# EAGLE schematic system (EAGLE 9.6.1)

## Sheet 1 of 2: 总架构图
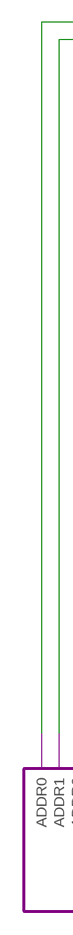
[diagram p0: schematic, sheet 1, part 1 of 2]
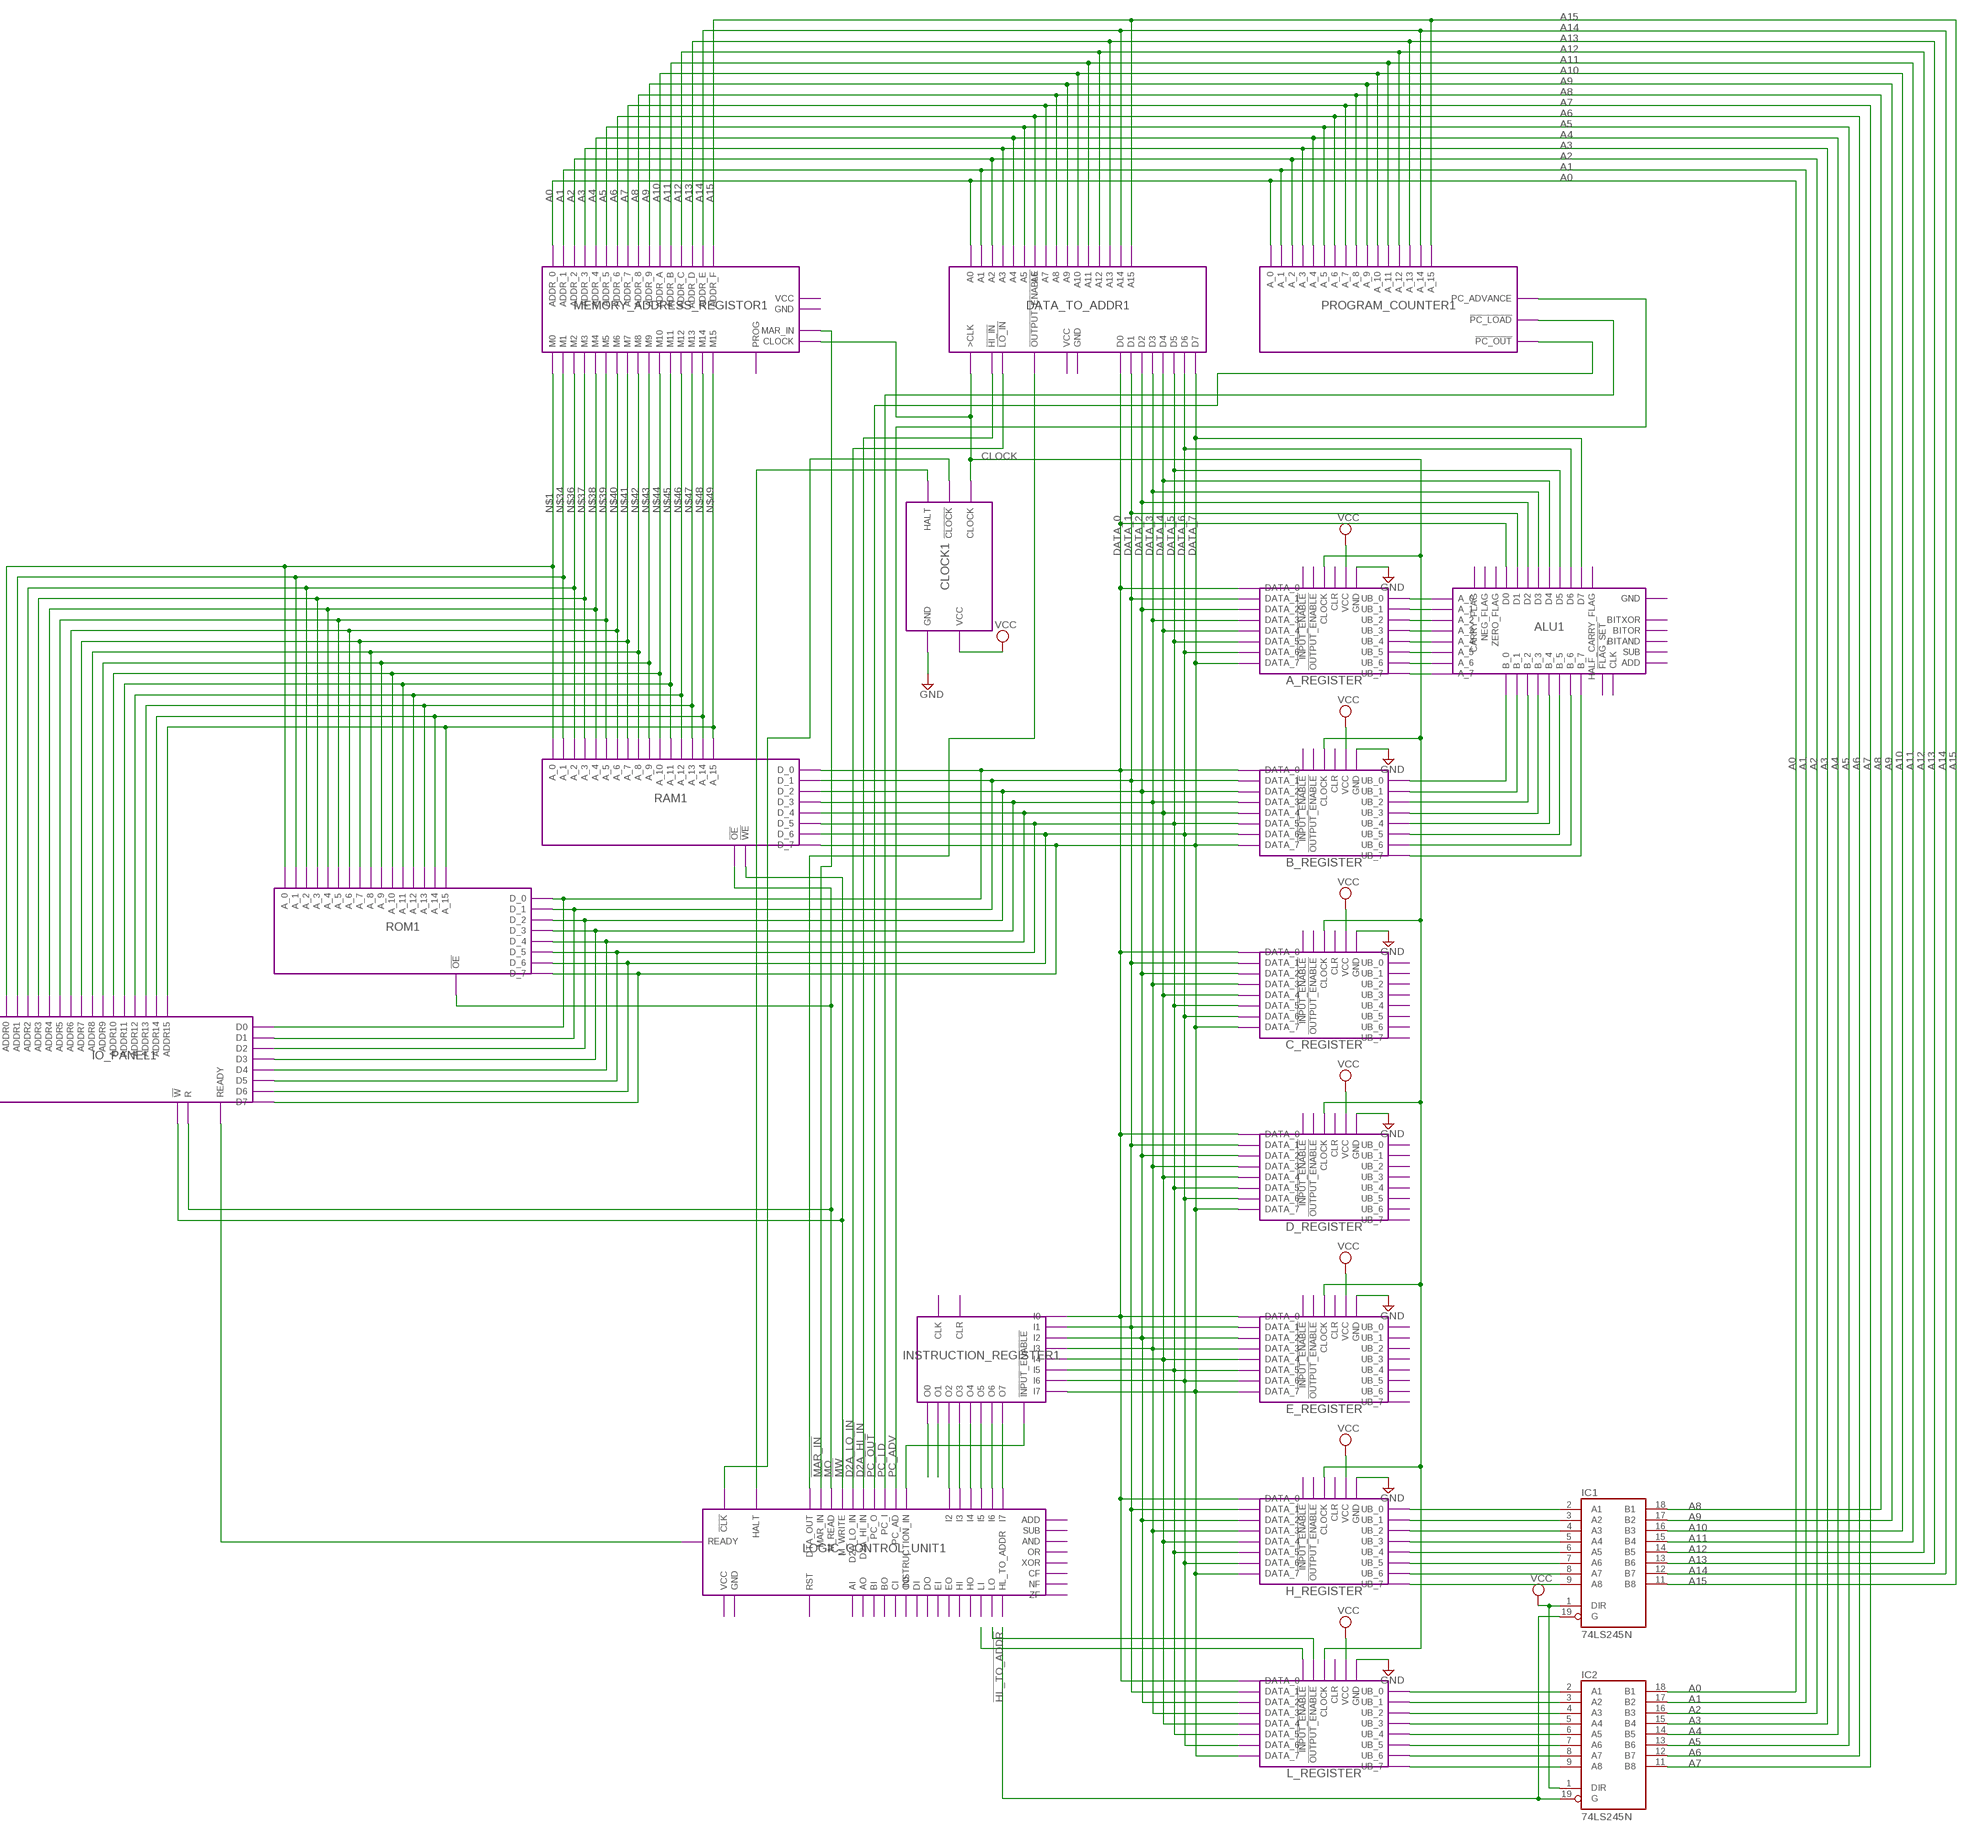
[diagram p1: schematic, sheet 1, part 2 of 2]

### Parts
IC1  74LS245N  [DIL20]
IC2  74LS245N  [DIL20]

### Module instances
CLOCK1 = CLOCK
A_REGISTER = DATA_REGISTOR
B_REGISTER = DATA_REGISTOR
MEMORY_ADDRESS_REGISTOR1 = MEMORY_ADDRESS_REGISTOR
ALU1 = ALU
PROGRAM_COUNTER1 = PROGRAM_COUNTER
RAM1 = RAM
INSTRUCTION_REGISTER1 = INSTRUCTION_REGISTER
IO_PANEL1 = IO_PANEL
LOGIC_CONTROL_UNIT1 = LOGIC_CONTROL_UNIT
C_REGISTER = DATA_REGISTOR
D_REGISTER = DATA_REGISTOR
E_REGISTER = DATA_REGISTOR
H_REGISTER = DATA_REGISTOR
L_REGISTER = DATA_REGISTOR
DATA_TO_ADDR1 = DATA_TO_ADDR
ROM1 = ROM

### Nets
!D2A_HI_IN: port DATA_TO_ADDR1.!HI_IN LOGIC_CONTROL_UNIT1.D2A_HI_IN
!D2A_LO_IN: port DATA_TO_ADDR1.!LO_IN LOGIC_CONTROL_UNIT1.D2A_LO_IN
!HL_TO_ADDR: IC1.19(G) IC2.19(G)
!MAR_IN: port MEMORY_ADDRESS_REGISTOR1.MAR_IN LOGIC_CONTROL_UNIT1.MAR_IN
!MO: port ROM1.!OE RAM1.!OE IO_PANEL1.R LOGIC_CONTROL_UNIT1.M_READ
!MW: port RAM1.!WE IO_PANEL1.!W LOGIC_CONTROL_UNIT1.M_WRITE
!PC_LD: port PROGRAM_COUNTER1.!PC_LOAD LOGIC_CONTROL_UNIT1.PC_I
!PC_OUT: port PROGRAM_COUNTER1.!PC_OUT LOGIC_CONTROL_UNIT1.PC_O
A0: IC2.18(B1) ; port MEMORY_ADDRESS_REGISTOR1.ADDR_0 DATA_TO_ADDR1.A0 PROGRAM_COUNTER1.A_0
A1: IC2.17(B2) ; port MEMORY_ADDRESS_REGISTOR1.ADDR_1 DATA_TO_ADDR1.A1 PROGRAM_COUNTER1.A_1
A2: IC2.16(B3) ; port MEMORY_ADDRESS_REGISTOR1.ADDR_2 DATA_TO_ADDR1.A2 PROGRAM_COUNTER1.A_2
A3: IC2.15(B4) ; port MEMORY_ADDRESS_REGISTOR1.ADDR_3 DATA_TO_ADDR1.A3 PROGRAM_COUNTER1.A_3
A4: IC2.14(B5) ; port MEMORY_ADDRESS_REGISTOR1.ADDR_4 DATA_TO_ADDR1.A4 PROGRAM_COUNTER1.A_4
A5: IC2.13(B6) ; port MEMORY_ADDRESS_REGISTOR1.ADDR_5 DATA_TO_ADDR1.A5 PROGRAM_COUNTER1.A_5
A6: IC2.12(B7) ; port MEMORY_ADDRESS_REGISTOR1.ADDR_6 DATA_TO_ADDR1.A6 PROGRAM_COUNTER1.A_6
A7: IC2.11(B8) ; port MEMORY_ADDRESS_REGISTOR1.ADDR_7 DATA_TO_ADDR1.A7 PROGRAM_COUNTER1.A_7
A8: IC1.18(B1) ; port MEMORY_ADDRESS_REGISTOR1.ADDR_8 DATA_TO_ADDR1.A8 PROGRAM_COUNTER1.A_8
A9: IC1.17(B2) ; port MEMORY_ADDRESS_REGISTOR1.ADDR_9 DATA_TO_ADDR1.A9 PROGRAM_COUNTER1.A_9
A10: IC1.16(B3) ; port MEMORY_ADDRESS_REGISTOR1.ADDR_A DATA_TO_ADDR1.A10 PROGRAM_COUNTER1.A_10
A11: IC1.15(B4) ; port MEMORY_ADDRESS_REGISTOR1.ADDR_B DATA_TO_ADDR1.A11 PROGRAM_COUNTER1.A_11
A12: IC1.14(B5) ; port MEMORY_ADDRESS_REGISTOR1.ADDR_C DATA_TO_ADDR1.A12 PROGRAM_COUNTER1.A_12
A13: IC1.13(B6) ; port MEMORY_ADDRESS_REGISTOR1.ADDR_D DATA_TO_ADDR1.A13 PROGRAM_COUNTER1.A_13
A14: IC1.12(B7) ; port MEMORY_ADDRESS_REGISTOR1.ADDR_E DATA_TO_ADDR1.A14 PROGRAM_COUNTER1.A_14
A15: IC1.11(B8) ; port MEMORY_ADDRESS_REGISTOR1.ADDR_F DATA_TO_ADDR1.A15 PROGRAM_COUNTER1.A_15
CLOCK: port MEMORY_ADDRESS_REGISTOR1.CLOCK CLOCK1.CLOCK L_REGISTER.CLOCK H_REGISTER.CLOCK E_REGISTER.CLOCK D_REGISTER.CLOCK C_REGISTER.CLOCK B_REGISTER.CLOCK A_REGISTER.CLOCK DATA_TO_ADDR1.>CLK
DATA_0: port A_REGISTER.DATA_0 B_REGISTER.DATA_0 C_REGISTER.DATA_0 D_REGISTER.DATA_0 E_REGISTER.DATA_0 H_REGISTER.DATA_0 L_REGISTER.DATA_0 DATA_TO_ADDR1.D0 ALU1.D0 INSTRUCTION_REGISTER1.I0 ROM1.D_0 IO_PANEL1.D0 ; also sheet 2
DATA_1: port A_REGISTER.DATA_1 B_REGISTER.DATA_1 C_REGISTER.DATA_1 D_REGISTER.DATA_1 E_REGISTER.DATA_1 H_REGISTER.DATA_1 L_REGISTER.DATA_1 DATA_TO_ADDR1.D1 ALU1.D1 INSTRUCTION_REGISTER1.I1 ROM1.D_1 IO_PANEL1.D1 ; also sheet 2
DATA_2: port A_REGISTER.DATA_2 B_REGISTER.DATA_2 C_REGISTER.DATA_2 D_REGISTER.DATA_2 E_REGISTER.DATA_2 H_REGISTER.DATA_2 L_REGISTER.DATA_2 DATA_TO_ADDR1.D2 ALU1.D2 INSTRUCTION_REGISTER1.I2 ROM1.D_2 IO_PANEL1.D2 ; also sheet 2
DATA_3: port A_REGISTER.DATA_3 B_REGISTER.DATA_3 C_REGISTER.DATA_3 D_REGISTER.DATA_3 E_REGISTER.DATA_3 H_REGISTER.DATA_3 L_REGISTER.DATA_3 DATA_TO_ADDR1.D3 ALU1.D3 INSTRUCTION_REGISTER1.I3 ROM1.D_3 IO_PANEL1.D3 ; also sheet 2
DATA_4: port A_REGISTER.DATA_4 B_REGISTER.DATA_4 C_REGISTER.DATA_4 D_REGISTER.DATA_4 E_REGISTER.DATA_4 H_REGISTER.DATA_4 L_REGISTER.DATA_4 DATA_TO_ADDR1.D4 ALU1.D4 INSTRUCTION_REGISTER1.I4 ROM1.D_4 IO_PANEL1.D4 ; also sheet 2
DATA_5: port A_REGISTER.DATA_5 B_REGISTER.DATA_5 C_REGISTER.DATA_5 D_REGISTER.DATA_5 E_REGISTER.DATA_5 H_REGISTER.DATA_5 L_REGISTER.DATA_5 DATA_TO_ADDR1.D5 ALU1.D5 INSTRUCTION_REGISTER1.I5 ROM1.D_5 IO_PANEL1.D5 ; also sheet 2
DATA_6: port A_REGISTER.DATA_6 B_REGISTER.DATA_6 C_REGISTER.DATA_6 D_REGISTER.DATA_6 E_REGISTER.DATA_6 H_REGISTER.DATA_6 L_REGISTER.DATA_6 DATA_TO_ADDR1.D6 ALU1.D6 INSTRUCTION_REGISTER1.I6 ROM1.D_6 IO_PANEL1.D6 ; also sheet 2
DATA_7: port A_REGISTER.DATA_7 B_REGISTER.DATA_7 C_REGISTER.DATA_7 D_REGISTER.DATA_7 E_REGISTER.DATA_7 H_REGISTER.DATA_7 L_REGISTER.DATA_7 DATA_TO_ADDR1.D7 ALU1.D7 INSTRUCTION_REGISTER1.I7 ROM1.D_7 IO_PANEL1.D7 ; also sheet 2
GND: port A_REGISTER.GND B_REGISTER.GND CLOCK1.GND C_REGISTER.GND D_REGISTER.GND E_REGISTER.GND H_REGISTER.GND L_REGISTER.GND ; also sheet 2
N$1: port MEMORY_ADDRESS_REGISTOR1.M0 RAM1.A_0 ROM1.A_0 IO_PANEL1.ADDR0
N$2: port A_REGISTER.UB_0 ALU1.A_0
N$3: port A_REGISTER.UB_1 ALU1.A_1
N$4: port A_REGISTER.UB_2 ALU1.A_2
N$5: port A_REGISTER.UB_3 ALU1.A_3
N$6: port A_REGISTER.UB_4 ALU1.A_4
N$7: port A_REGISTER.UB_5 ALU1.A_5
N$8: port A_REGISTER.UB_6 ALU1.A_6
N$9: port A_REGISTER.UB_7 ALU1.A_7
N$10: port B_REGISTER.UB_0 ALU1.B_0
N$11: port B_REGISTER.UB_1 ALU1.B_1
N$12: port ALU1.B_2 B_REGISTER.UB_2
N$13: port B_REGISTER.UB_3 ALU1.B_3
N$14: port ALU1.B_4 B_REGISTER.UB_4
N$15: port B_REGISTER.UB_5 ALU1.B_5
N$16: port ALU1.B_6 B_REGISTER.UB_6
N$17: port B_REGISTER.UB_7 ALU1.B_7
N$18: IC1.2(A1) ; port H_REGISTER.UB_0
N$19: IC1.3(A2) ; port H_REGISTER.UB_1
N$20: IC1.4(A3) ; port H_REGISTER.UB_2
N$21: IC1.5(A4) ; port H_REGISTER.UB_3
N$22: IC1.6(A5) ; port H_REGISTER.UB_4
N$23: IC1.7(A6) ; port H_REGISTER.UB_5
N$24: IC1.8(A7) ; port H_REGISTER.UB_6
N$25: IC1.9(A8) ; port H_REGISTER.UB_7
N$26: IC2.2(A1) ; port L_REGISTER.UB_0
N$27: IC2.3(A2) ; port L_REGISTER.UB_1
N$28: IC2.4(A3) ; port L_REGISTER.UB_2
N$29: IC2.5(A4) ; port L_REGISTER.UB_3
N$30: IC2.6(A5) ; port L_REGISTER.UB_4
N$31: IC2.7(A6) ; port L_REGISTER.UB_5
N$32: IC2.8(A7) ; port L_REGISTER.UB_6
N$33: IC2.9(A8) ; port L_REGISTER.UB_7
N$34: port RAM1.A_1 MEMORY_ADDRESS_REGISTOR1.M1 ROM1.A_1 IO_PANEL1.ADDR1
N$36: port MEMORY_ADDRESS_REGISTOR1.M2 RAM1.A_2 ROM1.A_2 IO_PANEL1.ADDR2
N$37: port RAM1.A_3 MEMORY_ADDRESS_REGISTOR1.M3 ROM1.A_3 IO_PANEL1.ADDR3
N$38: port MEMORY_ADDRESS_REGISTOR1.M4 RAM1.A_4 ROM1.A_4 IO_PANEL1.ADDR4
N$39: port RAM1.A_5 MEMORY_ADDRESS_REGISTOR1.M5 ROM1.A_5 IO_PANEL1.ADDR5
N$40: port MEMORY_ADDRESS_REGISTOR1.M6 RAM1.A_6 ROM1.A_6 IO_PANEL1.ADDR6
N$41: port RAM1.A_7 MEMORY_ADDRESS_REGISTOR1.M7 ROM1.A_7 IO_PANEL1.ADDR7
N$42: port MEMORY_ADDRESS_REGISTOR1.M8 RAM1.A_8 ROM1.A_8 IO_PANEL1.ADDR8
N$43: port RAM1.A_9 MEMORY_ADDRESS_REGISTOR1.M9 ROM1.A_9 IO_PANEL1.ADDR9
N$44: port MEMORY_ADDRESS_REGISTOR1.M10 RAM1.A_10 ROM1.A_10 IO_PANEL1.ADDR10
N$45: port RAM1.A_11 MEMORY_ADDRESS_REGISTOR1.M11 ROM1.A_11 IO_PANEL1.ADDR11
N$46: port MEMORY_ADDRESS_REGISTOR1.M12 RAM1.A_12 ROM1.A_12 IO_PANEL1.ADDR12
N$47: port RAM1.A_13 MEMORY_ADDRESS_REGISTOR1.M13 ROM1.A_13 IO_PANEL1.ADDR13
N$48: port MEMORY_ADDRESS_REGISTOR1.M14 RAM1.A_14 ROM1.A_14 IO_PANEL1.ADDR14
N$49: port RAM1.A_15 MEMORY_ADDRESS_REGISTOR1.M15 ROM1.A_15 IO_PANEL1.ADDR15
N$66: port LOGIC_CONTROL_UNIT1.DTA_OUT DATA_TO_ADDR1.!OUTPUT_ENABLE
N$77: port CLOCK1.!CLOCK LOGIC_CONTROL_UNIT1.!CLK
N$78: port CLOCK1.HALT LOGIC_CONTROL_UNIT1.HALT
N$81: port IO_PANEL1.READY LOGIC_CONTROL_UNIT1.READY
N$83: port INSTRUCTION_REGISTER1.!INPUT_ENABLE LOGIC_CONTROL_UNIT1.INSTRUCTION_IN
N$84: port INSTRUCTION_REGISTER1.O0
N$85: port INSTRUCTION_REGISTER1.O1
N$86: port INSTRUCTION_REGISTER1.O2 LOGIC_CONTROL_UNIT1.I2
N$87: port INSTRUCTION_REGISTER1.O3 LOGIC_CONTROL_UNIT1.I3
N$88: port INSTRUCTION_REGISTER1.O4 LOGIC_CONTROL_UNIT1.I4
N$89: port INSTRUCTION_REGISTER1.O5 LOGIC_CONTROL_UNIT1.I5
N$90: port INSTRUCTION_REGISTER1.O6 LOGIC_CONTROL_UNIT1.I6
N$91: port INSTRUCTION_REGISTER1.O7 LOGIC_CONTROL_UNIT1.I7
N$92: port L_REGISTER.!OUTPUT_ENABLE
N$93: port L_REGISTER.!INPUT_ENABLE
PC_ADV: port PROGRAM_COUNTER1.PC_ADVANCE LOGIC_CONTROL_UNIT1.PC_AD
VCC: IC1.1(DIR) IC2.1(DIR) ; port A_REGISTER.VCC B_REGISTER.VCC CLOCK1.VCC C_REGISTER.VCC D_REGISTER.VCC E_REGISTER.VCC H_REGISTER.VCC L_REGISTER.VCC ; also sheet 2

## Sheet 2 of 2: Register A, Register B and ALU assembly
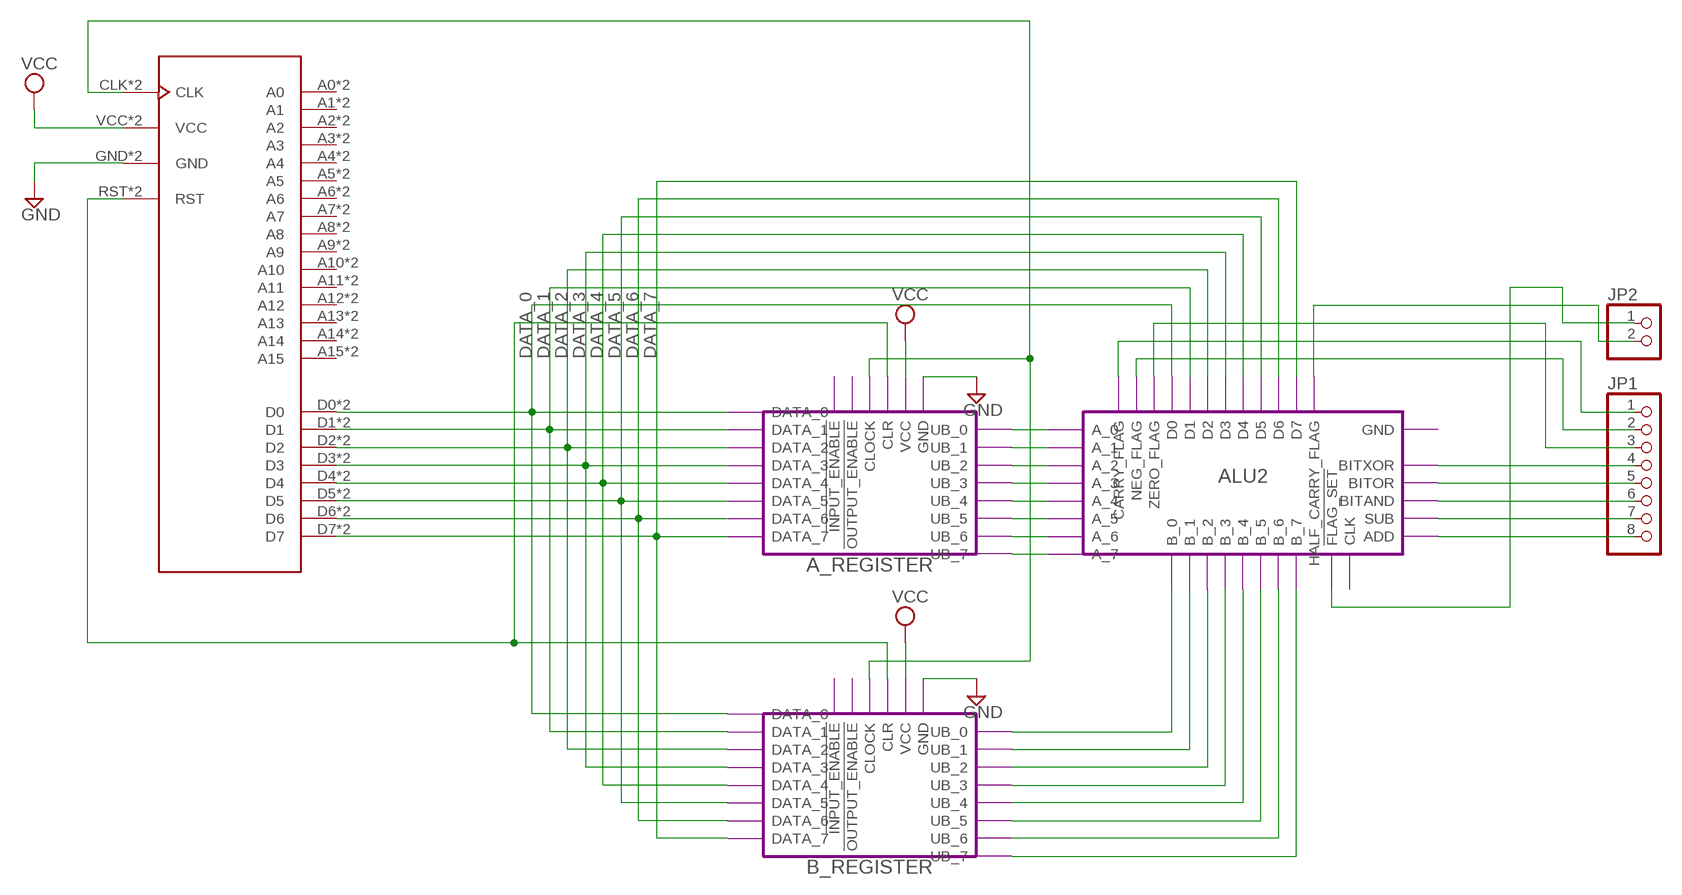
[diagram p2: schematic, sheet 2]

### Parts
JP1  PINHD-1X8/90  [1X08/90]
JP2  PINHD-1X2/90  [1X02/90]
U$1  PORT_BOARD  [PORT_FOOTPT]

### Module instances
A_REGISTER1 = DATA_REGISTOR
B_REGISTER1 = DATA_REGISTOR
ALU2 = ALU

### Nets
CLOCK1: U$1.CLK U$1.CLK1(CLK) ; port B_REGISTER1.CLOCK A_REGISTER1.CLOCK
DATA_0: U$1.D0 U$1.D8(D0) ; port A_REGISTER1.DATA_0 B_REGISTER1.DATA_0 ALU2.D0 ; also sheet 1
DATA_1: U$1.D1 U$1.D9(D1) ; port A_REGISTER1.DATA_1 B_REGISTER1.DATA_1 ALU2.D1 ; also sheet 1
DATA_2: U$1.D2 U$1.D10(D2) ; port A_REGISTER1.DATA_2 B_REGISTER1.DATA_2 ALU2.D2 ; also sheet 1
DATA_3: U$1.D3 U$1.D11(D3) ; port A_REGISTER1.DATA_3 B_REGISTER1.DATA_3 ALU2.D3 ; also sheet 1
DATA_4: U$1.D4 U$1.D12(D4) ; port A_REGISTER1.DATA_4 B_REGISTER1.DATA_4 ALU2.D4 ; also sheet 1
DATA_5: U$1.D5 U$1.D13(D5) ; port A_REGISTER1.DATA_5 B_REGISTER1.DATA_5 ALU2.D5 ; also sheet 1
DATA_6: U$1.D6 U$1.D14(D6) ; port A_REGISTER1.DATA_6 B_REGISTER1.DATA_6 ALU2.D6 ; also sheet 1
DATA_7: U$1.D7 U$1.D15(D7) ; port A_REGISTER1.DATA_7 B_REGISTER1.DATA_7 ALU2.D7 ; also sheet 1
GND: U$1.GND U$1.GND1(GND) ; port A_REGISTER1.GND B_REGISTER1.GND ; also sheet 1
N$35: port A_REGISTER1.UB_0 ALU2.A_0
N$50: port A_REGISTER1.UB_1 ALU2.A_1
N$51: port A_REGISTER1.UB_2 ALU2.A_2
N$52: port A_REGISTER1.UB_3 ALU2.A_3
N$53: port A_REGISTER1.UB_4 ALU2.A_4
N$54: port A_REGISTER1.UB_5 ALU2.A_5
N$55: port A_REGISTER1.UB_6 ALU2.A_6
N$56: port A_REGISTER1.UB_7 ALU2.A_7
N$57: port B_REGISTER1.UB_0 ALU2.B_0
N$58: port B_REGISTER1.UB_1 ALU2.B_1
N$59: port ALU2.B_2 B_REGISTER1.UB_2
N$60: port B_REGISTER1.UB_3 ALU2.B_3
N$61: port ALU2.B_4 B_REGISTER1.UB_4
N$62: port B_REGISTER1.UB_5 ALU2.B_5
N$63: port ALU2.B_6 B_REGISTER1.UB_6
N$64: port B_REGISTER1.UB_7 ALU2.B_7
N$65: U$1.RST U$1.RST1(RST) ; port A_REGISTER1.CLR B_REGISTER1.CLR
N$67: JP1.1 ; port ALU2.CARRY_FLAG
N$68: JP1.2 ; port ALU2.NEG_FLAG
N$69: JP1.3 ; port ALU2.ZERO_FLAG
N$70: JP1.4 ; port ALU2.BITXOR
N$71: JP1.5 ; port ALU2.BITOR
N$72: JP1.6 ; port ALU2.BITAND
N$73: JP1.7 ; port ALU2.SUB
N$74: JP1.8 ; port ALU2.ADD
N$75: JP2.2 ; port ALU2.HALF_CARRY_FLAG
N$76: JP2.1 ; port ALU2.!FLAG_SET
VCC: U$1.VCC U$1.VCC1(VCC) ; port A_REGISTER1.VCC B_REGISTER1.VCC ; also sheet 1
Unconnected: U$1.A0 U$1.A1 U$1.A2 U$1.A3 U$1.A4 U$1.A5 U$1.A6 U$1.A7 U$1.A8 U$1.A9 U$1.A10 U$1.A11 U$1.A12 U$1.A13 U$1.A14 U$1.A15 U$1.A16(A0) U$1.A17(A1) U$1.A18(A2) U$1.A19(A3) U$1.A20(A4) U$1.A21(A5) U$1.A22(A6) U$1.A23(A7) U$1.A24(A8) U$1.A25(A9) U$1.A26(A10) U$1.A27(A11) U$1.A28(A12) U$1.A29(A13) U$1.A30(A14) U$1.A31(A15)

## Power pins joined to a net without a drawn wire
GND: IC1.10(GND) IC2.10(GND)
VCC: IC1.20(VCC) IC2.20(VCC)

## Library data of the parts
IC1 IC2 = 74xx-eu:74*245: Octal BUS TRANSCEIVER, 3-state
JP1 = pinhead:PINHD-1X8: PIN HEADER
JP2 = pinhead:PINHD-1X2: PIN HEADER
U$1 = stack_interface:PORT_BOARD

## Module CLOCK
Ports: CLOCK(out) HALT(in) GND(pwr) VCC(pwr) !CLOCK(out)
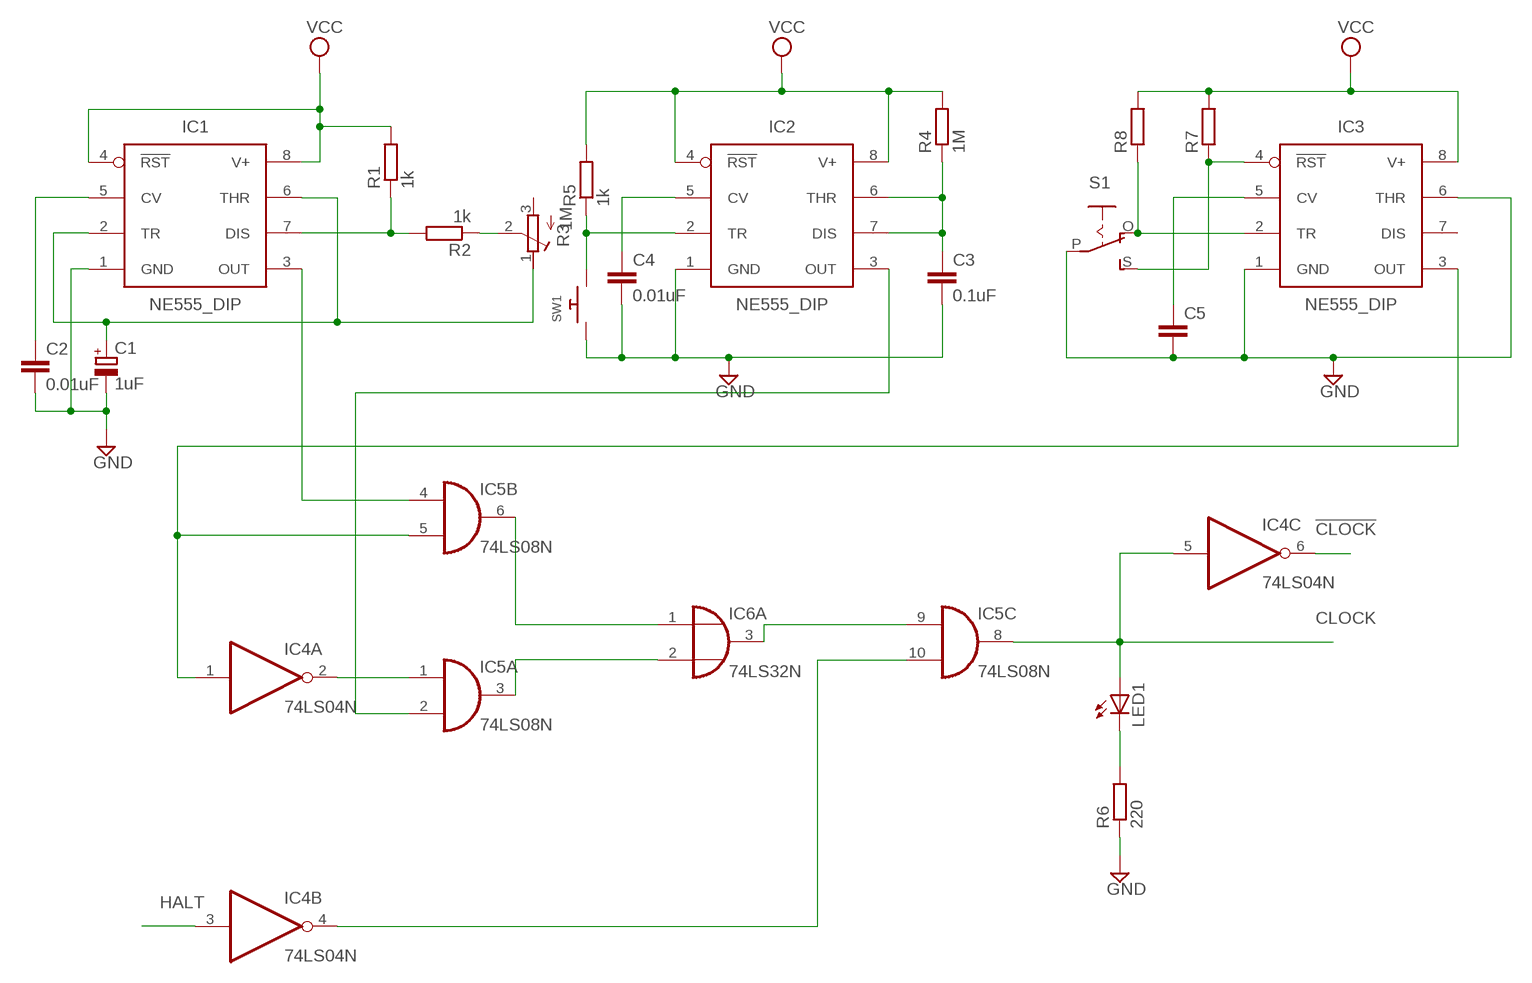
[diagram p3: schematic, module CLOCK, sheet 1]

### Parts
C1  1uF  CPOL-EUE2-5  [E2-5]
C2  0.01uF  C-EU025-025X050  [C025-025X050]
C3  0.1uF  C-EU025-025X050  [C025-025X050]
C4  0.01uF  C-EU025-025X050  [C025-025X050]
C5  C-EU025-025X050  [C025-025X050]
IC1  NE555_DIP  [DIP826W53P254L959H508Q8B]
IC2  NE555_DIP  [DIP826W53P254L959H508Q8B]
IC3  NE555_DIP  [DIP826W53P254L959H508Q8B]
IC4  74LS04N  [DIL14]
IC5  74LS08N  [DIL14]
IC6  74LS32N  [DIL14]
LED1  LED3MM  [LED3MM]
R1  1k  R-EU_0204/7  [0204/7]
R2  1k  R-EU_0204/7  [0204/7]
R3  1M  R-TRIMM3314J  [RTRIM3314J]
R4  1M  R-EU_0207/7  [0207/7]
R5  1k  R-EU_0207/7  [0207/7]
R6  220  R-EU_0207/7  [0207/7]
R7  R-EU_0207/7  [0207/7]
R8  R-EU_0207/7  [0207/7]
S1  EG1218S  [EG1218]
SW1  SWITCH_PUSHBUTTONSOFTTOUCHSMD_SJ  [PUSHBUTTON_SMD_SJ]

### Nets
!CLOCK: IC4.6(C:O)
CLOCK: IC4.5(C:I) IC5.8(C:O) LED1.A
GND: C1.- C2.2 C3.2 C4.2 C5.2 IC1.1(GND) IC2.1(GND) IC3.1(GND) IC3.6(THR) R6.1 S1.P SW1.P$1
HALT: IC4.3(B:I)
N$1: IC1.7(DIS) R1.1 R2.2
N$2: R2.1 R3.2(S)
N$3: C1.+ IC1.2(TR) IC1.6(THR) R3.1(E)
N$4: C3.1 IC2.6(THR) IC2.7(DIS) R4.1
N$5: C2.1 IC1.5(CV)
N$6: IC1.3(OUT) IC5.4(B:I0)
N$7: IC4.2(A:O) IC5.1(A:I0)
N$8: IC2.3(OUT) IC5.2(A:I1)
N$9: IC3.3(OUT) IC4.1(A:I) IC5.5(B:I1)
N$10: IC5.6(B:O) IC6.1(A:I0)
N$11: IC5.3(A:O) IC6.2(A:I1)
N$12: IC4.4(B:O) IC5.10(C:I1)
N$13: IC5.9(C:I0) IC6.3(A:O)
N$14: C4.1 IC2.5(CV)
N$15: IC2.2(TR) R5.1 SW1.P$2
N$16: LED1.K(C) R6.2
N$17: IC3.2(TR) R8.1 S1.O
N$18: IC3.4(!RST) R7.1 S1.S
N$19: C5.1 IC3.5(CV)
VCC: IC1.4(!RST) IC1.8(V+) IC2.4(!RST) IC2.8(V+) IC3.8(V+) R1.2 R4.2 R5.2 R7.2 R8.2
Unconnected: IC3.7(DIS) IC4.8(D:O) IC4.9(D:I) IC4.10(E:O) IC4.11(E:I) IC4.12(F:O) IC4.13(F:I) IC5.11(D:O) IC5.12(D:I0) IC5.13(D:I1) IC6.4(B:I0) IC6.5(B:I1) IC6.6(B:O) IC6.8(C:O) IC6.9(C:I0) IC6.10(C:I1) IC6.11(D:O) IC6.12(D:I0) IC6.13(D:I1) R3.3(A)

### Power pins joined to a net without a drawn wire
GND: IC4.7(P:GND) IC5.7(P:GND) IC6.7(P:GND)
VCC: IC4.14(P:VCC) IC5.14(P:VCC) IC6.14(P:VCC)

### Library data of the parts
C1 = resistor:CPOL-EU: POLARIZED CAPACITOR, European symbol; SPICEPREFIX: C
C2-C5 = resistor:C-EU: CAPACITOR, European symbol; SPICEPREFIX: C
IC1 = IC_Clock-Timing:*555: TIMER 555 General purpose precision timers NE555 : Texas Datasheet <http://www.ti.com/general/docs/suppproductinfo.tsp?distId=10&gotoUrl=http%3A%2F%2Fwww.ti.com%2Flit%2Fgpn%2Fne555>, Diodes Incorporated Datasheet <https://www.diodes.com/assets/Datasheets/NE555_SA555_NA555.pdf> LM555 Datasheet <http://www.ti.com/general/docs/suppproductinfo.tsp?distId=10&gotoUrl=http%3A%2F%2Fwww.ti.com%2Flit%2Fgpn%2Flm555> LMC555 Datasheet <http://www.ti.com/general/docs/suppproductinfo.tsp?distId=10&gotoUrl=http%3A%2F%2Fwww.ti.com%2Flit%2Fgpn%2Flmc555> ICM7555 : Maxim Integrated Datasheet <https://datasheets.maximintegrated.com/en/ds/ICM7555-ICM7556.pdf>, Renesas Electronics America Inc Datasheet <https://www.renesas.com/en-us/www/doc/datasheet/icm7555-56.pdf>; CATEGORY: IC_Clock-Timing; CURRENT-SUPPLY: 10mA; DESCRIPTION: IC OSC SINGLE TIMER 100KHZ 8-DIP; FREQUENCY: 100kHz; MANUFACTURER: Texas Instruments; MPN: NE555P; OPERATING_TEMP: 0°C to 70°C; PART_STATUS: Active; ROHS_COMPLIANT: ROHS3 Compliant; SPICEMODEL: NE555; SPICEPREFIX: X; SUB-CATEGORY: Timer
IC2 IC3 = IC_Clock-Timing:*555: TIMER 555 General purpose precision timers NE555 : Texas Datasheet <http://www.ti.com/general/docs/suppproductinfo.tsp?distId=10&gotoUrl=http%3A%2F%2Fwww.ti.com%2Flit%2Fgpn%2Fne555>, Diodes Incorporated Datasheet <https://www.diodes.com/assets/Datasheets/NE555_SA555_NA555.pdf> LM555 Datasheet <http://www.ti.com/general/docs/suppproductinfo.tsp?distId=10&gotoUrl=http%3A%2F%2Fwww.ti.com%2Flit%2Fgpn%2Flm555> LMC555 Datasheet <http://www.ti.com/general/docs/suppproductinfo.tsp?distId=10&gotoUrl=http%3A%2F%2Fwww.ti.com%2Flit%2Fgpn%2Flmc555> ICM7555 : Maxim Integrated Datasheet <https://datasheets.maximintegrated.com/en/ds/ICM7555-ICM7556.pdf>, Renesas Electronics America Inc Datasheet <https://www.renesas.com/en-us/www/doc/datasheet/icm7555-56.pdf>; CATEGORY: IC_Clock-Timing; CURRENT-SUPPLY: 10mA; DESCRIPTION: IC OSC SINGLE TIMER 100KHZ 8-DIP; FREQUENCY: 100kHz; MANUFACTURER: Texas Instruments; MPN: NE555P; OPERATING_TEMP: 0°C to 70°C; PART_STATUS: Active; ROHS_COMPLIANT: ROHS3 Compliant; SUB-CATEGORY: Timer
IC4 = 74xx-eu:74*04: Hex INVERTER
IC5 = 74xx-eu:74*08: Quad 2-input AND gate; SPICEPREFIX: J
IC6 = 74xx-eu:74*32: Quad 2-input OR gate
LED1 = adafruit:LED: LED OSRAM: - CHIPLED LG R971, LG N971, LY N971, LG Q971, LY Q971, LO R971, LY R971 LH N974, LH R974 LS Q976, LO Q976, LY Q976 LO Q996 - Hyper CHIPLED LW Q18S LB Q993, LB Q99A, LB R99A - SideLED LS A670, LO A670, LY A670, LG A670, LP A670 LB A673, LV A673, LT A673, LW A673 LH A674 LY A675 LS A676, LA A676, LO A676, LY A676, LW A676 LS A679, LY A679, LG A679 - Hyper Micro SIDELED® LS Y876, LA Y876, LO Y876, LY Y876 LT Y87S - SmartLED LW L88C, LW L88S LB L89C, LB L89S, LG L890 LS L89K, LO L89K, LY L89K LS L896, LA L896, LO L896, LY L896 - TOPLED LS T670, LO T670, LY T670, LG T670, LP T670 LSG T670, LSP T670, LSY T670, LOP T670, LYG T670 LG T671, LOG T671, LSG T671 LB T673, LV T673, LT T673, LW T673 LH T674 LS T676, LA T676, LO T676, LY T676, LB T676, LH T676, LSB T676, LW T676 LB T67C, LV T67C, LT T67C, LS T67K, LO T67K, LY T67K, LW E67C LS E67B, LA E67B, LO E67B, LY E67B, LB E67C, LV E67C, LT E67C LW T67C LS T679, LY T679, LG T679 LS T770, LO T770, LY T770, LG T770, LP T770 LB T773, LV T773, LT T773, LW T773 LH T774 LS E675, LA E675, LY E675, LS T675 LS T776, LA T776, LO T776, LY T776, LB T776 LHGB T686 LT T68C, LB T68C - Hyper Mini TOPLED® LB M676 - Mini TOPLED Santana® LG M470 LS M47K, LO M47K, LY M47K Source: http://www.osram.convergy.de/
R1 R2 = resistor:R-EU_: RESISTOR, European symbol; SPICEPREFIX: R
R3 = resistor:R-TRIMM: Trimm resistor; SPICEPREFIX: X
R4-R8 = resistor:R-EU_: RESISTOR, European symbol
S1 = adafruit:EG1218: SLIDING SWITCH 0.1" spacing through hole, vertical SPDT slide switch http://www.ladyada.net/library/pcb/eaglelibrary.html
SW1 = adafruit:SWITCH_PUSHBUTTON: Buttons SOFTTOUCHSMD_SJ - Soft touch temporary push button (Super Junk Akihabara) Compatible with SKPMANE010 [Mouser: 688-SKPMAN] C&K_KSS = Digikey: KSS221GLFS; SPICEPREFIX: B

## Module DATA_REGISTOR
Ports: DATA_0(io) DATA_1(io) DATA_2(io) DATA_3(io) DATA_4(io) DATA_5(io) DATA_6(io) DATA_7(io) !INPUT_ENABLE(in) !OUTPUT_ENABLE(in) CLOCK(in) CLR(in) UB_0(out) UB_1(out) UB_2(out) UB_3(out) UB_4(out) UB_5(out) UB_6(out) UB_7(out) VCC(pwr) GND(pwr)
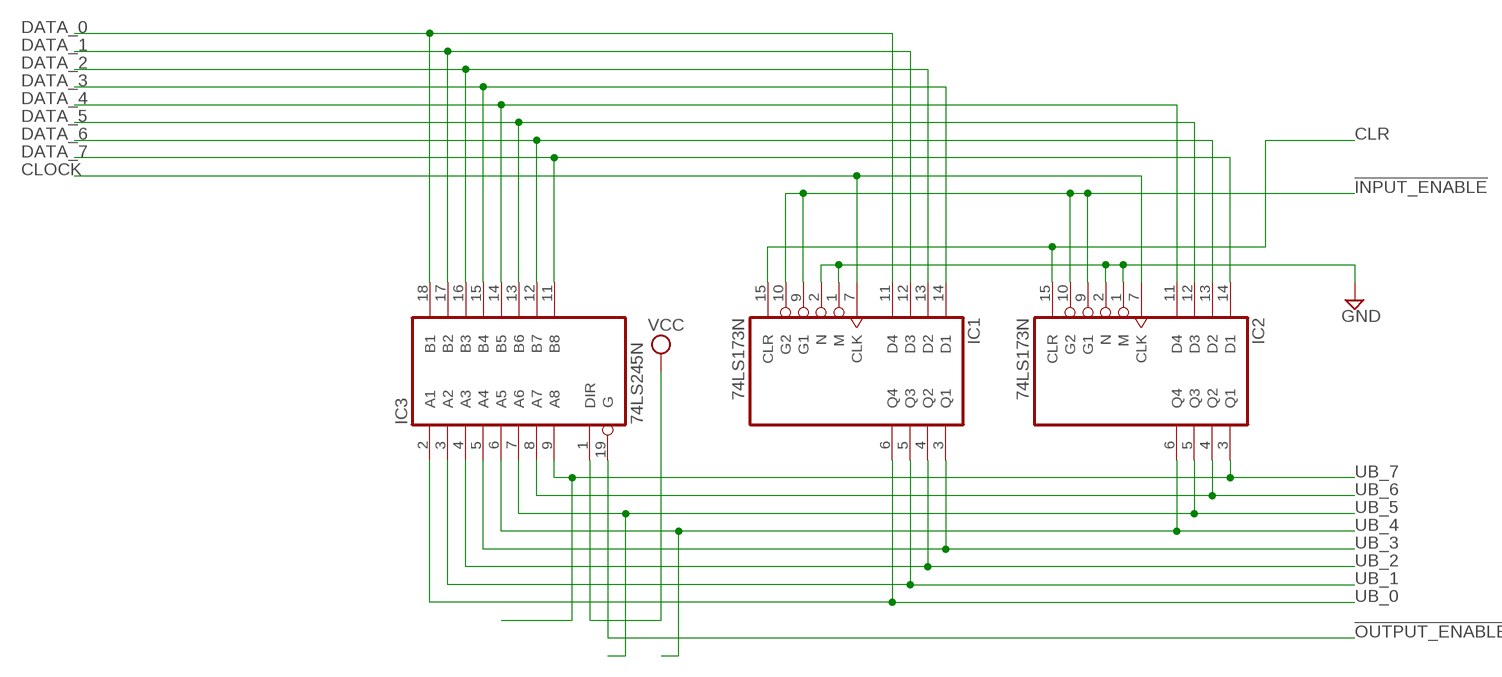
[diagram p4: schematic, module DATA_REGISTOR, sheet 1]

### Parts
IC1  74LS173N  [DIL16]
IC2  74LS173N  [DIL16]
IC3  74LS245N  [DIL20]

### Nets
!INPUT_ENABLE: IC1.9(G1) IC1.10(G2) IC2.9(G1) IC2.10(G2)
!OUTPUT_ENABLE: IC3.19(G)
CLOCK: IC1.7(CLK) IC2.7(CLK)
CLR: IC1.15(CLR) IC2.15(CLR)
DATA_0: IC1.11(D4) IC3.18(B1)
DATA_1: IC1.12(D3) IC3.17(B2)
DATA_2: IC1.13(D2) IC3.16(B3)
DATA_3: IC1.14(D1) IC3.15(B4)
DATA_4: IC2.11(D4) IC3.14(B5)
DATA_5: IC2.12(D3) IC3.13(B6)
DATA_6: IC2.13(D2) IC3.12(B7)
DATA_7: IC2.14(D1) IC3.11(B8)
GND: IC1.1(M) IC1.2(N) IC2.1(M) IC2.2(N)
UB_0: IC1.6(Q4) IC3.2(A1)
UB_1: IC1.5(Q3) IC3.3(A2)
UB_2: IC1.4(Q2) IC3.4(A3)
UB_3: IC1.3(Q1) IC3.5(A4)
UB_4: IC2.6(Q4) IC3.6(A5)
UB_5: IC2.5(Q3) IC3.7(A6)
UB_6: IC2.4(Q2) IC3.8(A7)
UB_7: IC2.3(Q1) IC3.9(A8)
VCC: IC3.1(DIR)

### Power pins joined to a net without a drawn wire
GND: IC1.8(GND) IC2.8(GND) IC3.10(GND)
VCC: IC1.16(VCC) IC2.16(VCC) IC3.20(VCC)

### Library data of the parts
IC1 IC2 = 74xx-eu:74*173: 4-bit D type REGISTER, 3-state
IC3 = 74xx-eu:74*245: Octal BUS TRANSCEIVER, 3-state

## Module MEMORY_ADDRESS_REGISTOR
Ports: ADDR_0(in) ADDR_1(in) ADDR_2(in) ADDR_3(in) ADDR_4(in) ADDR_5(in) ADDR_6(in) ADDR_7(in) ADDR_8(in) ADDR_9(in) ADDR_A(in) ADDR_B(in) ADDR_C(in) ADDR_D(in) ADDR_E(in) ADDR_F(in) CLOCK(in) MAR_IN(in) PROG(out) M0(out) M1(out) M2(out) M3(out) M4(out) M5(out) M6(out) M7(out) M8(out) M9(out) M10(out) M11(out) M12(out) M13(out) M14(out) M15(out) GND(pwr) VCC(pwr)
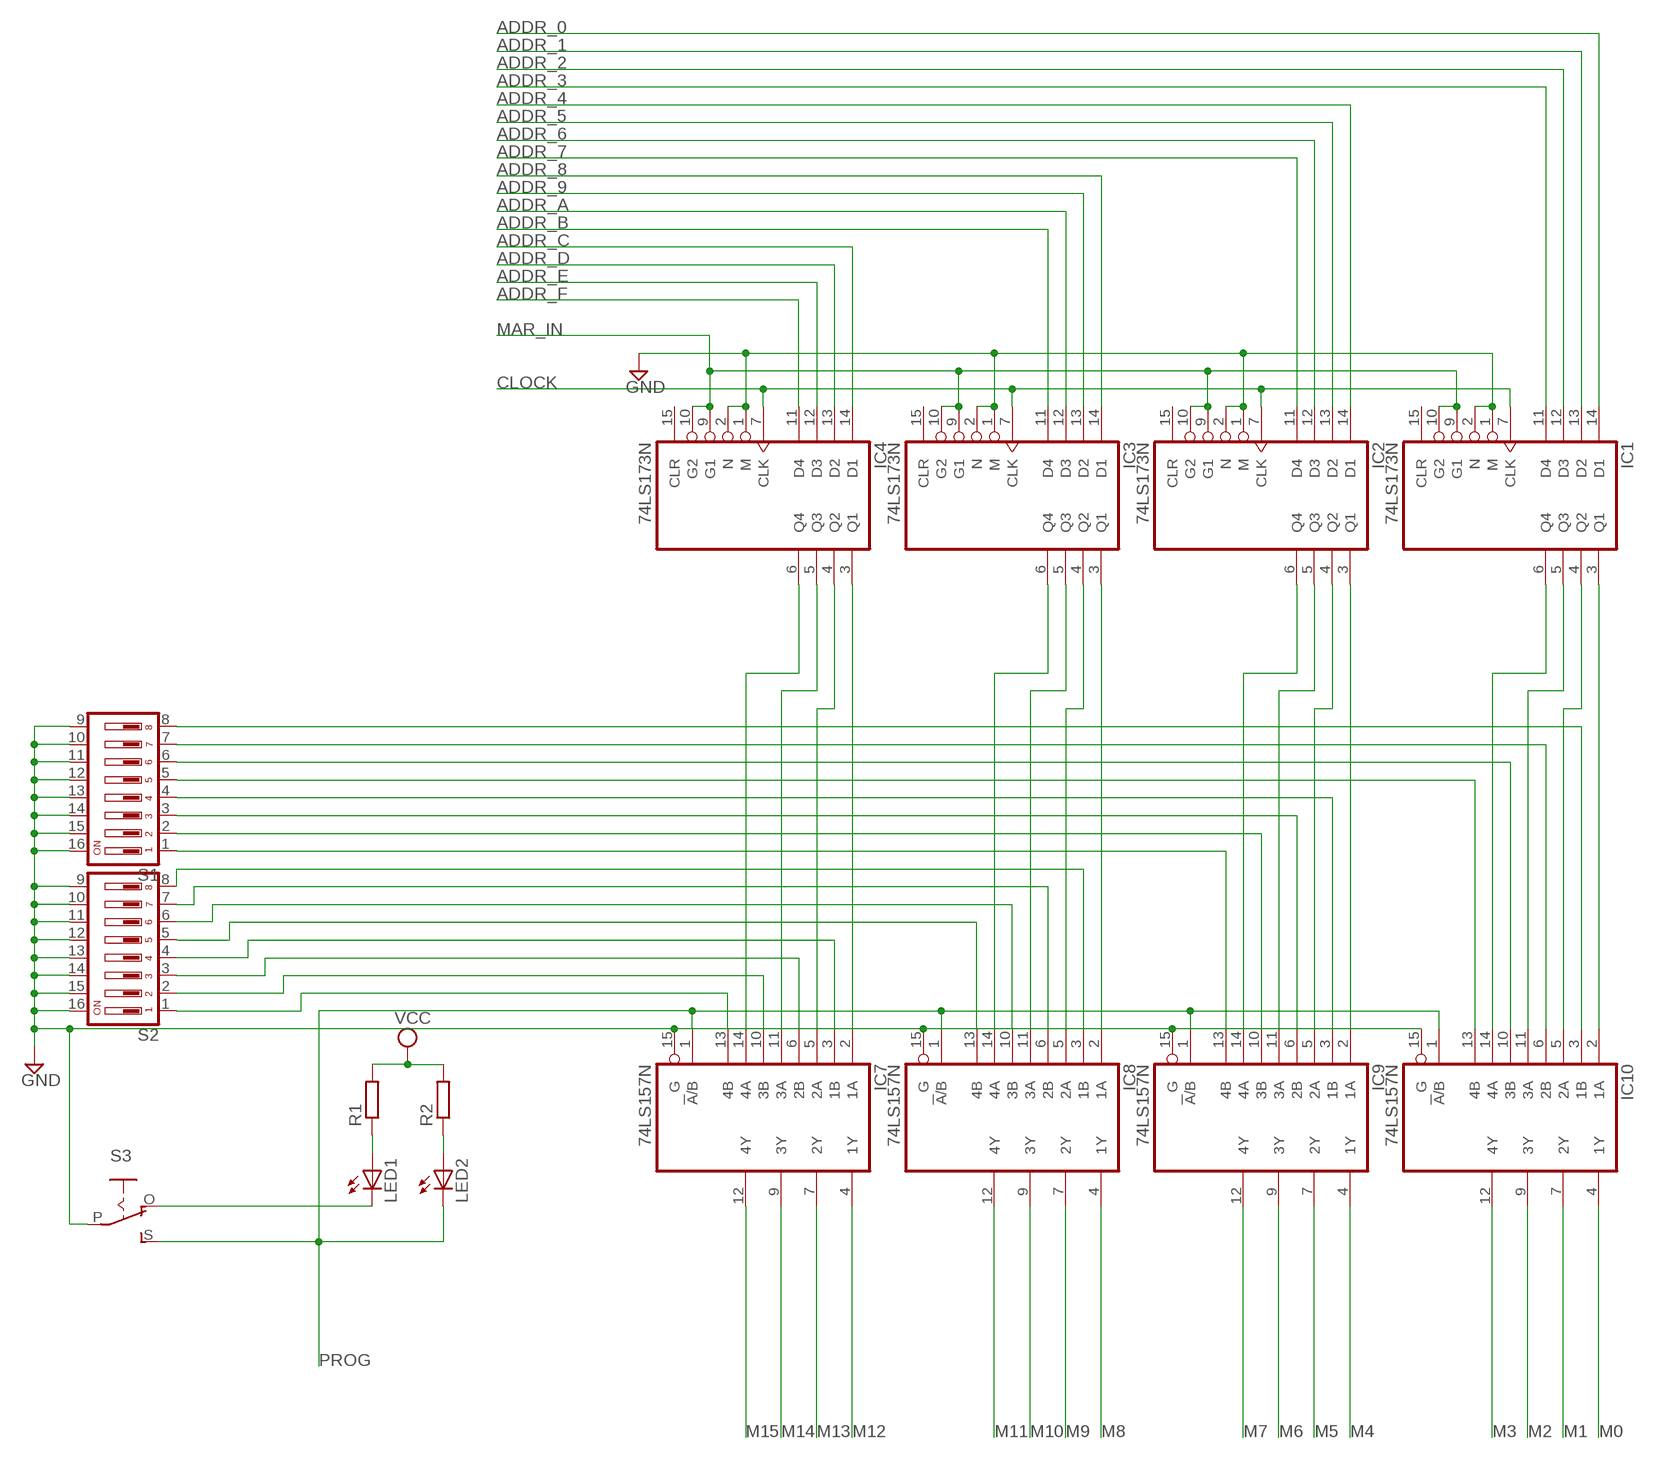
[diagram p5: schematic, module MEMORY_ADDRESS_REGISTOR, sheet 1]

### Parts
IC1  74LS173N  [DIL16]
IC2  74LS173N  [DIL16]
IC3  74LS173N  [DIL16]
IC4  74LS173N  [DIL16]
IC7  74LS157N  [DIL16]
IC8  74LS157N  [DIL16]
IC9  74LS157N  [DIL16]
IC10  74LS157N  [DIL16]
LED1  LED3MM  [LED3MM]
LED2  LED3MM  [LED3MM]
R1  R-EU_0207/7  [0207/7]
R2  R-EU_0207/7  [0207/7]
S1  DP08  [DP-08]
S2  DP08  [DP-08]
S3  EG1218S  [EG1218]

### Nets
ADDR_0: IC1.14(D1)
ADDR_1: IC1.13(D2)
ADDR_2: IC1.12(D3)
ADDR_3: IC1.11(D4)
ADDR_4: IC2.14(D1)
ADDR_5: IC2.13(D2)
ADDR_6: IC2.12(D3)
ADDR_7: IC2.11(D4)
ADDR_8: IC3.14(D1)
ADDR_9: IC3.13(D2)
ADDR_A: IC3.12(D3)
ADDR_B: IC3.11(D4)
ADDR_C: IC4.14(D1)
ADDR_D: IC4.13(D2)
ADDR_E: IC4.12(D3)
ADDR_F: IC4.11(D4)
CLOCK: IC1.7(CLK) IC2.7(CLK) IC3.7(CLK) IC4.7(CLK)
GND: IC1.1(M) IC1.2(N) IC2.1(M) IC2.2(N) IC3.1(M) IC3.2(N) IC4.1(M) IC4.2(N) IC7.15(G) IC8.15(G) IC9.15(G) IC10.15(G) S1.9 S1.10 S1.11 S1.12 S1.13 S1.14 S1.15 S1.16 S2.9 S2.10 S2.11 S2.12 S2.13 S2.14 S2.15 S2.16 S3.P
M0: IC10.4(1Y)
M1: IC10.7(2Y)
M2: IC10.9(3Y)
M3: IC10.12(4Y)
M4: IC9.4(1Y)
M5: IC9.7(2Y)
M6: IC9.9(3Y)
M7: IC9.12(4Y)
M8: IC8.4(1Y)
M9: IC8.7(2Y)
M10: IC8.9(3Y)
M11: IC8.12(4Y)
M12: IC7.4(1Y)
M13: IC7.7(2Y)
M14: IC7.9(3Y)
M15: IC7.12(4Y)
MAR_IN: IC1.9(G1) IC1.10(G2) IC2.9(G1) IC2.10(G2) IC3.9(G1) IC3.10(G2) IC4.9(G1) IC4.10(G2)
N$18: IC7.13(4B) S2.1
N$19: IC7.10(3B) S2.2
N$20: IC7.6(2B) S2.3
N$21: IC7.3(1B) S2.4
N$22: IC8.13(4B) S2.5
N$23: IC8.10(3B) S2.6
N$25: IC8.6(2B) S2.7
N$26: IC8.3(1B) S2.8
N$27: IC9.13(4B) S1.1
N$28: IC9.10(3B) S1.2
N$29: IC9.6(2B) S1.3
N$30: IC9.3(1B) S1.4
N$31: IC10.13(4B) S1.5
N$32: IC10.10(3B) S1.6
N$33: IC10.6(2B) S1.7
N$34: IC10.3(1B) S1.8
N$35: IC1.3(Q1) IC10.2(1A)
N$36: IC1.4(Q2) IC10.5(2A)
N$37: IC1.5(Q3) IC10.11(3A)
N$38: IC1.6(Q4) IC10.14(4A)
N$39: IC2.3(Q1) IC9.2(1A)
N$40: IC2.4(Q2) IC9.5(2A)
N$41: IC2.5(Q3) IC9.11(3A)
N$42: IC2.6(Q4) IC9.14(4A)
N$43: IC3.3(Q1) IC8.2(1A)
N$44: IC3.4(Q2) IC8.5(2A)
N$45: IC3.5(Q3) IC8.11(3A)
N$46: IC3.6(Q4) IC8.14(4A)
N$47: IC4.3(Q1) IC7.2(1A)
N$48: IC4.4(Q2) IC7.5(2A)
N$49: IC4.5(Q3) IC7.11(3A)
N$50: IC4.6(Q4) IC7.14(4A)
N$51: LED2.A R2.1
N$52: LED1.A R1.1
N$56: LED1.K(C) S3.O
PROG: IC7.1(!A!/B) IC8.1(!A!/B) IC9.1(!A!/B) IC10.1(!A!/B) LED2.K(C) S3.S
VCC: R1.2 R2.2
Unconnected: IC1.15(CLR) IC2.15(CLR) IC3.15(CLR) IC4.15(CLR)

### Power pins joined to a net without a drawn wire
GND: IC1.8(GND) IC2.8(GND) IC3.8(GND) IC4.8(GND) IC7.8(GND) IC8.8(GND) IC9.8(GND) IC10.8(GND)
VCC: IC1.16(VCC) IC2.16(VCC) IC3.16(VCC) IC4.16(VCC) IC7.16(VCC) IC8.16(VCC) IC9.16(VCC) IC10.16(VCC)

### Library data of the parts
IC1-IC4 = 74xx-eu:74*173: 4-bit D type REGISTER, 3-state
IC7-IC10 = 74xx-eu:74*157: Quadruple 2-line to 1-line data SELECTOR/MULTIPLEXER
LED1 LED2 = adafruit:LED: LED OSRAM: - CHIPLED LG R971, LG N971, LY N971, LG Q971, LY Q971, LO R971, LY R971 LH N974, LH R974 LS Q976, LO Q976, LY Q976 LO Q996 - Hyper CHIPLED LW Q18S LB Q993, LB Q99A, LB R99A - SideLED LS A670, LO A670, LY A670, LG A670, LP A670 LB A673, LV A673, LT A673, LW A673 LH A674 LY A675 LS A676, LA A676, LO A676, LY A676, LW A676 LS A679, LY A679, LG A679 - Hyper Micro SIDELED® LS Y876, LA Y876, LO Y876, LY Y876 LT Y87S - SmartLED LW L88C, LW L88S LB L89C, LB L89S, LG L890 LS L89K, LO L89K, LY L89K LS L896, LA L896, LO L896, LY L896 - TOPLED LS T670, LO T670, LY T670, LG T670, LP T670 LSG T670, LSP T670, LSY T670, LOP T670, LYG T670 LG T671, LOG T671, LSG T671 LB T673, LV T673, LT T673, LW T673 LH T674 LS T676, LA T676, LO T676, LY T676, LB T676, LH T676, LSB T676, LW T676 LB T67C, LV T67C, LT T67C, LS T67K, LO T67K, LY T67K, LW E67C LS E67B, LA E67B, LO E67B, LY E67B, LB E67C, LV E67C, LT E67C LW T67C LS T679, LY T679, LG T679 LS T770, LO T770, LY T770, LG T770, LP T770 LB T773, LV T773, LT T773, LW T773 LH T774 LS E675, LA E675, LY E675, LS T675 LS T776, LA T776, LO T776, LY T776, LB T776 LHGB T686 LT T68C, LB T68C - Hyper Mini TOPLED® LB M676 - Mini TOPLED Santana® LG M470 LS M47K, LO M47K, LY M47K Source: http://www.osram.convergy.de/
R1 R2 = resistor:R-EU_: RESISTOR, European symbol
S1 S2 = switch-dil:DP08: DIL/CODE SWITCH; MPN: DP08; OC_FARNELL: 9471626; OC_NEWARK: 73J0035
S3 = adafruit:EG1218: SLIDING SWITCH 0.1" spacing through hole, vertical SPDT slide switch http://www.ladyada.net/library/pcb/eaglelibrary.html

## Module ALU
Ports: A_0(in) A_1(in) A_2(in) A_3(in) A_4(in) A_5(in) A_6(in) A_7(in) B_0(in) B_1(in) B_2(in) B_3(in) B_4(in) B_5(in) B_6(in) B_7(in) ADD(in) SUB(in) BITAND(in) BITOR(in) BITXOR(in) D0(out) D1(out) D2(out) D3(out) D4(out) D5(out) D6(out) D7(out) GND(pwr) !FLAG_SET(in) CARRY_FLAG(out) NEG_FLAG(out) CLK(in) ZERO_FLAG(out) HALF_CARRY_FLAG(out)
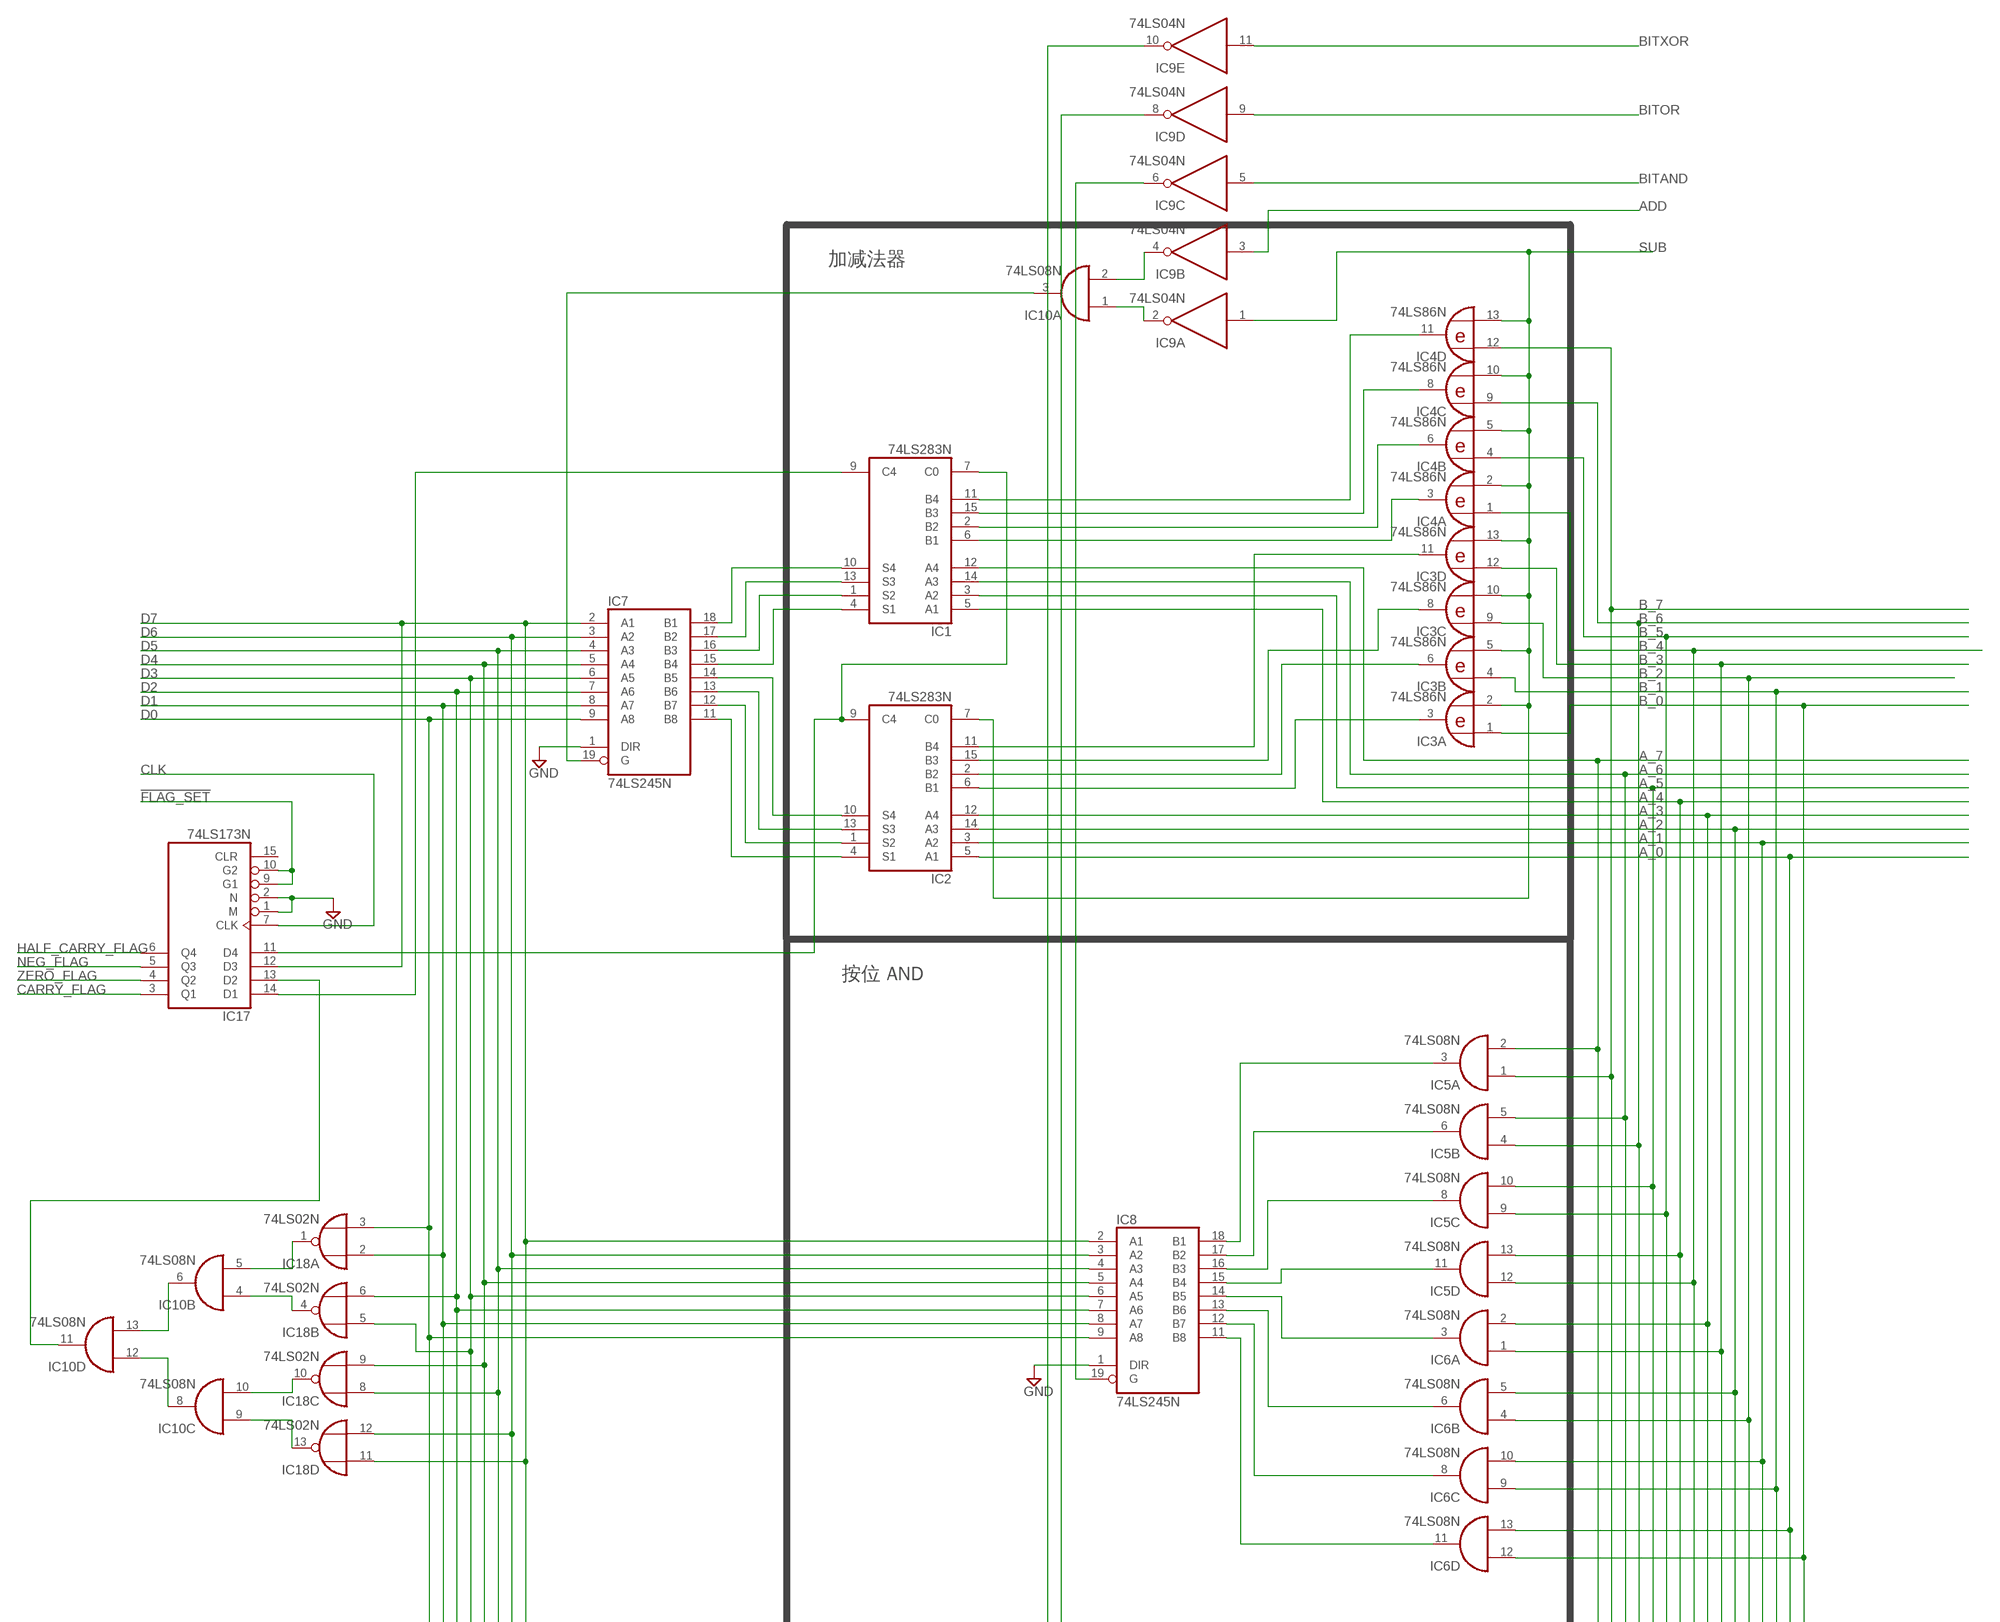
[diagram p6: schematic, module ALU, sheet 1, part 1 of 2]
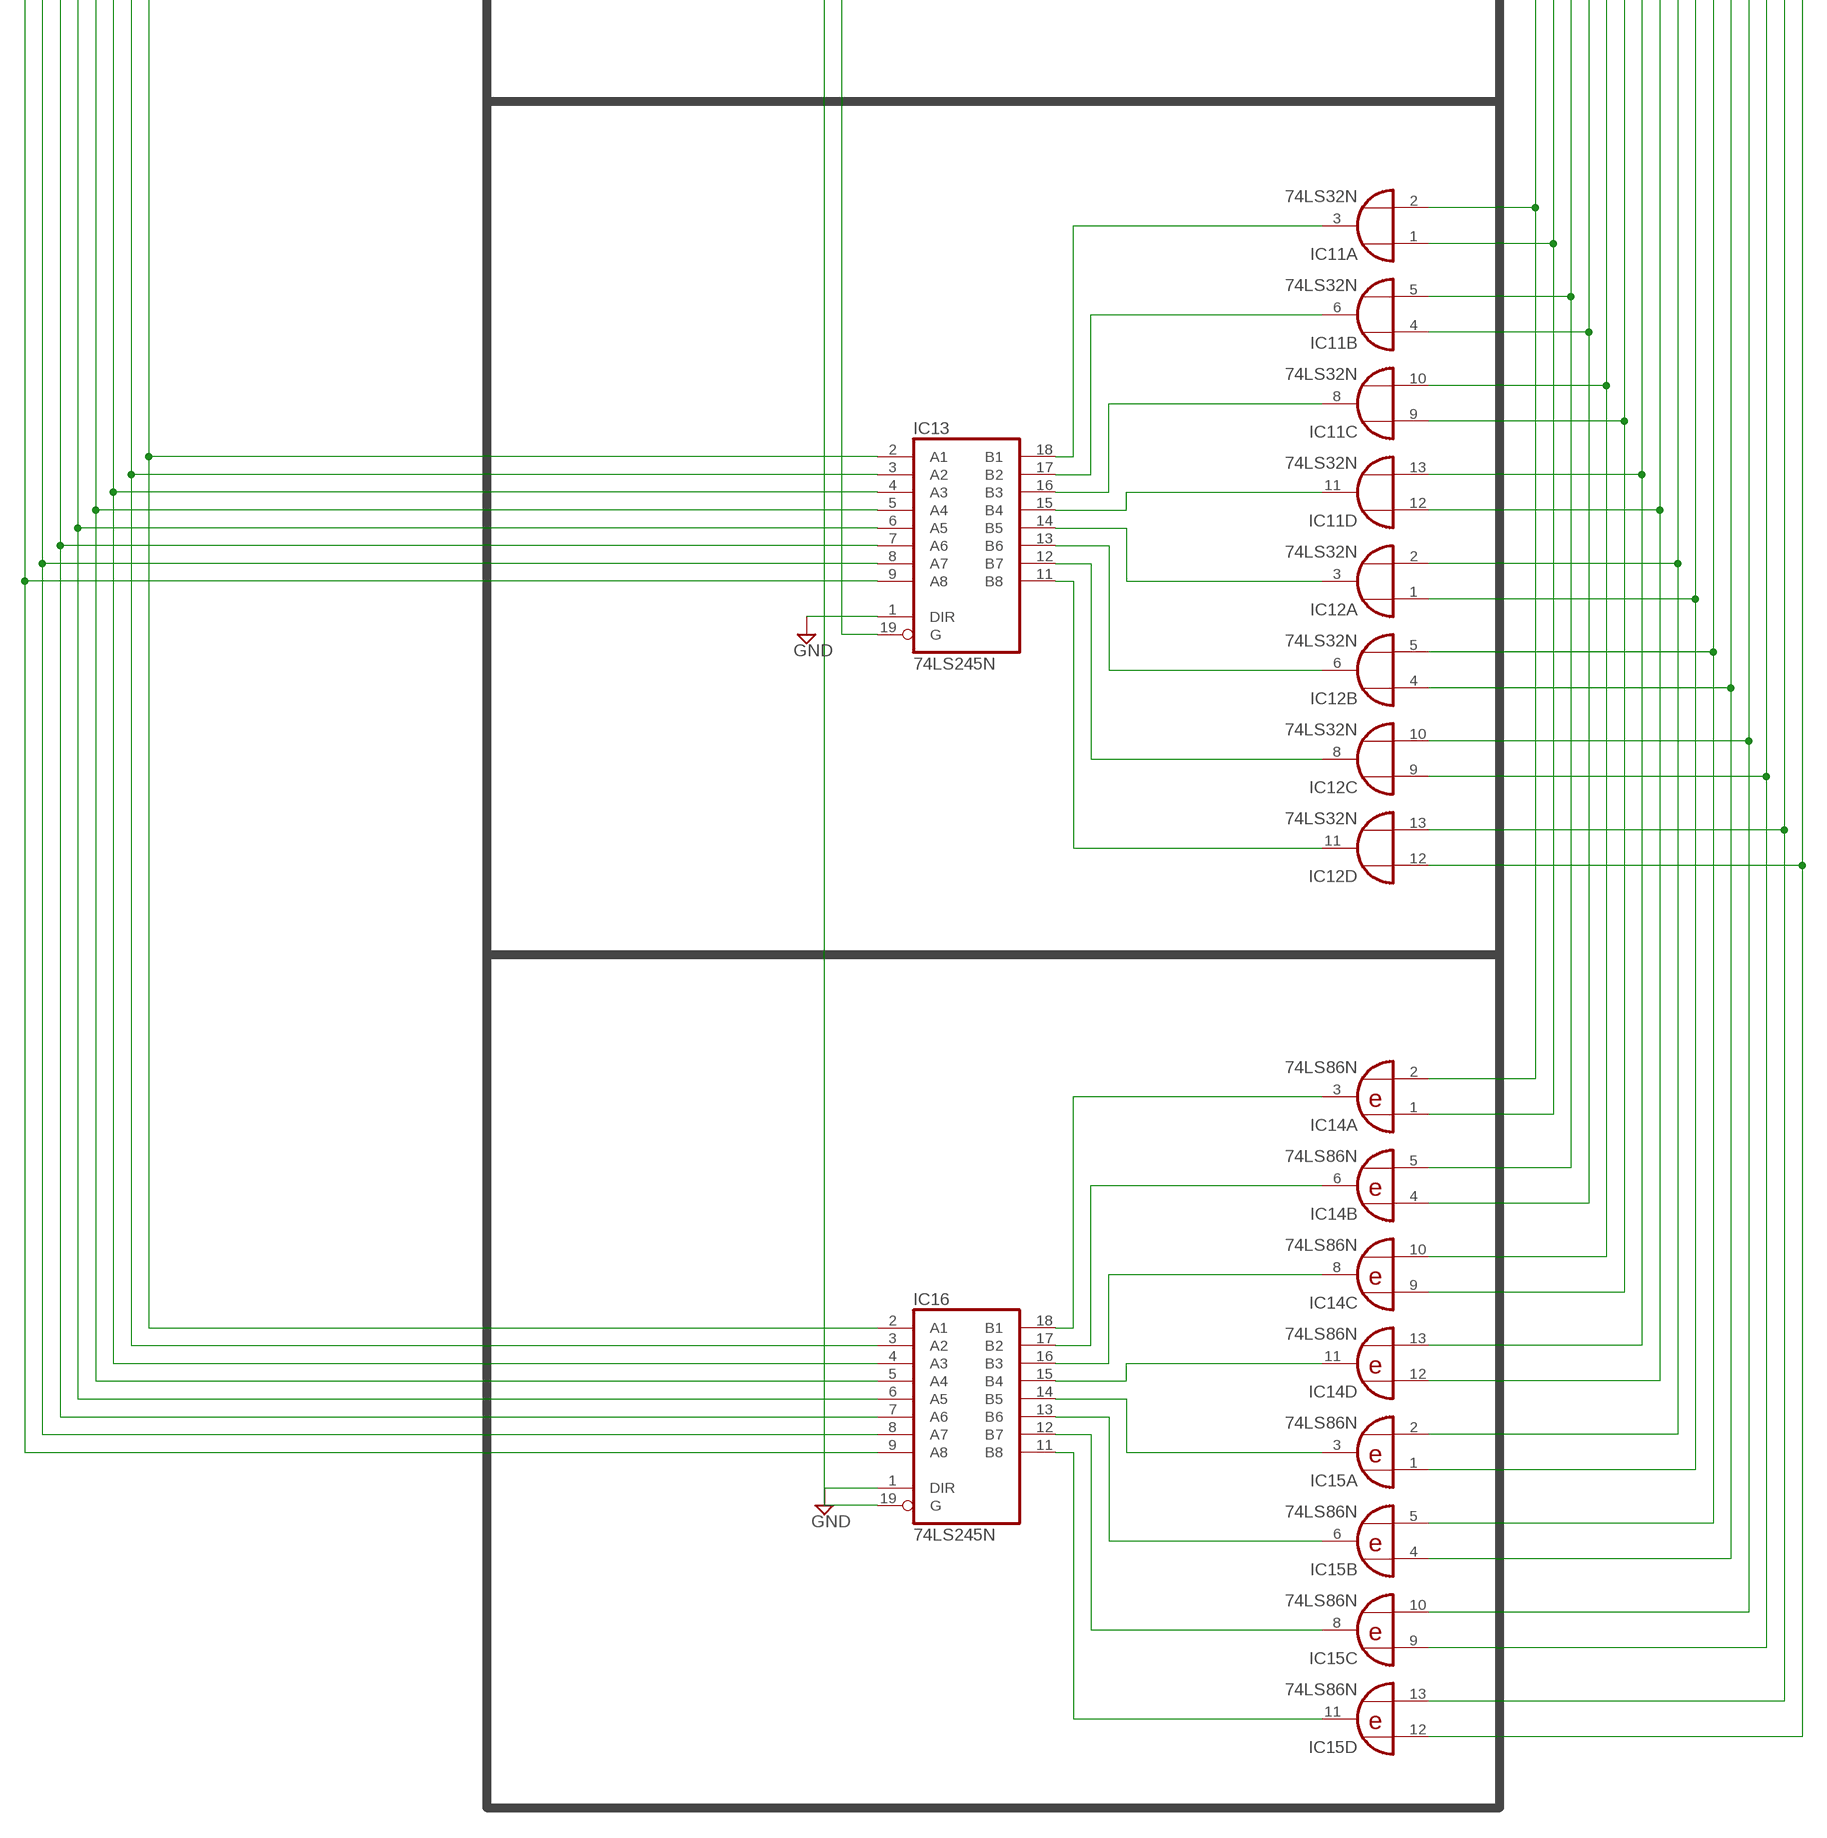
[diagram p7: schematic, module ALU, sheet 1, part 2 of 2]

### Parts
IC1  74LS283N  [DIL16]
IC2  74LS283N  [DIL16]
IC3  74LS86N  [DIL14]
IC4  74LS86N  [DIL14]
IC5  74LS08N  [DIL14]
IC6  74LS08N  [DIL14]
IC7  74LS245N  [DIL20]
IC8  74LS245N  [DIL20]
IC9  74LS04N  [DIL14]
IC10  74LS08N  [DIL14]
IC11  74LS32N  [DIL14]
IC12  74LS32N  [DIL14]
IC13  74LS245N  [DIL20]
IC14  74LS86N  [DIL14]
IC15  74LS86N  [DIL14]
IC16  74LS245N  [DIL20]
IC17  74LS173N  [DIL16]
IC18  74LS02N  [DIL14]

### Nets
!FLAG_SET: IC17.9(G1) IC17.10(G2)
A_0: IC2.5(A1) IC6.13(D:I1) IC12.13(D:I1) IC15.13(D:I1)
A_1: IC2.3(A2) IC6.10(C:I1) IC12.10(C:I1) IC15.10(C:I1)
A_2: IC2.14(A3) IC6.5(B:I1) IC12.5(B:I1) IC15.5(B:I1)
A_3: IC2.12(A4) IC6.2(A:I1) IC12.2(A:I1) IC15.2(A:I1)
A_4: IC1.5(A1) IC5.13(D:I1) IC11.13(D:I1) IC14.13(D:I1)
A_5: IC1.3(A2) IC5.10(C:I1) IC11.10(C:I1) IC14.10(C:I1)
A_6: IC1.14(A3) IC5.5(B:I1) IC11.5(B:I1) IC14.5(B:I1)
A_7: IC1.12(A4) IC5.2(A:I1) IC11.2(A:I1) IC14.2(A:I1)
ADD: IC9.3(B:I)
B_0: IC3.1(A:I0) IC6.12(D:I0) IC12.12(D:I0) IC15.12(D:I0)
B_1: IC3.4(B:I0) IC6.9(C:I0) IC12.9(C:I0) IC15.9(C:I0)
B_2: IC3.9(C:I0) IC6.4(B:I0) IC12.4(B:I0) IC15.4(B:I0)
B_3: IC3.12(D:I0) IC6.1(A:I0) IC12.1(A:I0) IC15.1(A:I0)
B_4: IC4.1(A:I0) IC5.12(D:I0) IC11.12(D:I0) IC14.12(D:I0)
B_5: IC4.4(B:I0) IC5.9(C:I0) IC11.9(C:I0) IC14.9(C:I0)
B_6: IC4.9(C:I0) IC5.4(B:I0) IC11.4(B:I0) IC14.4(B:I0)
B_7: IC4.12(D:I0) IC5.1(A:I0) IC11.1(A:I0) IC14.1(A:I0)
BITAND: IC9.5(C:I)
BITOR: IC9.9(D:I)
BITXOR: IC9.11(E:I)
CARRY_FLAG: IC17.3(Q1)
CLK: IC17.7(CLK)
D0: IC7.9(A8) IC8.9(A8) IC13.9(A8) IC16.9(A8) IC18.3(A:I1)
D1: IC7.8(A7) IC8.8(A7) IC13.8(A7) IC16.8(A7) IC18.2(A:I0)
D2: IC7.7(A6) IC8.7(A6) IC13.7(A6) IC16.7(A6) IC18.6(B:I1)
D3: IC7.6(A5) IC8.6(A5) IC13.6(A5) IC16.6(A5) IC18.5(B:I0)
D4: IC7.5(A4) IC8.5(A4) IC13.5(A4) IC16.5(A4) IC18.9(C:I1)
D5: IC7.4(A3) IC8.4(A3) IC13.4(A3) IC16.4(A3) IC18.8(C:I0)
D6: IC7.3(A2) IC8.3(A2) IC13.3(A2) IC16.3(A2) IC18.12(D:I1)
D7: IC7.2(A1) IC8.2(A1) IC13.2(A1) IC16.2(A1) IC17.12(D3) IC18.11(D:I0)
GND: IC7.1(DIR) IC8.1(DIR) IC13.1(DIR) IC16.1(DIR) IC17.1(M) IC17.2(N)
HALF_CARRY_FLAG: IC17.6(Q4)
N$1: IC1.7(C0) IC2.9(C4) IC17.11(D4)
N$2: IC2.10(S4) IC7.14(B5)
N$3: IC1.4(S1) IC7.15(B4)
N$4: IC2.4(S1) IC7.11(B8)
N$5: IC2.1(S2) IC7.12(B7)
N$6: IC2.13(S3) IC7.13(B6)
N$7: IC1.1(S2) IC7.16(B3)
N$8: IC1.13(S3) IC7.17(B2)
N$9: IC1.10(S4) IC7.18(B1)
N$10: IC2.6(B1) IC3.3(A:O)
N$11: IC2.2(B2) IC3.6(B:O)
N$12: IC2.15(B3) IC3.8(C:O)
N$13: IC2.11(B4) IC3.11(D:O)
N$14: IC1.6(B1) IC4.3(A:O)
N$15: IC1.2(B2) IC4.6(B:O)
N$16: IC1.15(B3) IC4.8(C:O)
N$17: IC1.11(B4) IC4.11(D:O)
N$18: IC5.3(A:O) IC8.18(B1)
N$19: IC5.6(B:O) IC8.17(B2)
N$20: IC5.8(C:O) IC8.16(B3)
N$21: IC5.11(D:O) IC8.15(B4)
N$22: IC6.3(A:O) IC8.14(B5)
N$23: IC6.6(B:O) IC8.13(B6)
N$24: IC6.8(C:O) IC8.12(B7)
N$25: IC6.11(D:O) IC8.11(B8)
N$26: IC9.2(A:O) IC10.1(A:I0)
N$27: IC9.4(B:O) IC10.2(A:I1)
N$28: IC7.19(G) IC10.3(A:O)
N$29: IC8.19(G) IC9.6(C:O)
N$30: IC11.3(A:O) IC13.18(B1)
N$31: IC14.3(A:O) IC16.18(B1)
N$32: IC11.8(C:O) IC13.16(B3)
N$33: IC11.11(D:O) IC13.15(B4)
N$34: IC12.3(A:O) IC13.14(B5)
N$35: IC12.6(B:O) IC13.13(B6)
N$36: IC12.8(C:O) IC13.12(B7)
N$37: IC12.11(D:O) IC13.11(B8)
N$38: IC9.8(D:O) IC13.19(G)
N$39: IC11.6(B:O) IC13.17(B2)
N$40: IC14.6(B:O) IC16.17(B2)
N$41: IC14.8(C:O) IC16.16(B3)
N$42: IC14.11(D:O) IC16.15(B4)
N$43: IC15.3(A:O) IC16.14(B5)
N$44: IC15.6(B:O) IC16.13(B6)
N$45: IC15.8(C:O) IC16.12(B7)
N$46: IC15.11(D:O) IC16.11(B8)
N$47: IC9.10(E:O) IC16.19(G)
N$48: IC1.9(C4) IC17.14(D1)
N$49: IC10.6(B:O) IC10.13(D:I1)
N$50: IC10.8(C:O) IC10.12(D:I0)
N$51: IC10.5(B:I1) IC18.1(A:O)
N$52: IC10.4(B:I0) IC18.4(B:O)
N$53: IC10.10(C:I1) IC18.10(C:O)
N$54: IC10.9(C:I0) IC18.13(D:O)
N$55: IC10.11(D:O) IC17.13(D2)
NEG_FLAG: IC17.5(Q3)
SUB: IC2.7(C0) IC3.2(A:I1) IC3.5(B:I1) IC3.10(C:I1) IC3.13(D:I1) IC4.2(A:I1) IC4.5(B:I1) IC4.10(C:I1) IC4.13(D:I1) IC9.1(A:I)
ZERO_FLAG: IC17.4(Q2)
Unconnected: IC9.12(F:O) IC9.13(F:I) IC17.15(CLR)

### Notes on the sheet
- 加减法器
- 按位 AND

### Power pins joined to a net without a drawn wire
GND: IC1.8(GND) IC2.8(GND) IC3.7(P:GND) IC4.7(P:GND) IC5.7(P:GND) IC6.7(P:GND) IC7.10(GND) IC8.10(GND) IC9.7(P:GND) IC10.7(P:GND) IC11.7(P:GND) IC12.7(P:GND) IC13.10(GND) IC14.7(P:GND) IC15.7(P:GND) IC16.10(GND) IC17.8(GND) IC18.7(P:GND)
VCC: IC1.16(VCC) IC2.16(VCC) IC3.14(P:VCC) IC4.14(P:VCC) IC5.14(P:VCC) IC6.14(P:VCC) IC7.20(VCC) IC8.20(VCC) IC9.14(P:VCC) IC10.14(P:VCC) IC11.14(P:VCC) IC12.14(P:VCC) IC13.20(VCC) IC14.14(P:VCC) IC15.14(P:VCC) IC16.20(VCC) IC17.16(VCC) IC18.14(P:VCC)

### Library data of the parts
IC1 IC2 = 74xx-eu:74*283: 4-bit binary FULL ADDER, fast carry
IC3 IC4 IC14 IC15 = 74xx-eu:74*86: Quad 2-input EXCLUSIVE-OR (XOR) gate
IC5 IC6 IC10 = 74xx-eu:74*08: Quad 2-input AND gate
IC7 IC8 IC13 IC16 = 74xx-eu:74*245: Octal BUS TRANSCEIVER, 3-state
IC9 = 74xx-eu:74*04: Hex INVERTER
IC11 = 74xx-eu:74*32: Quad 2-input OR gate; SPICEPREFIX: J
IC12 = 74xx-eu:74*32: Quad 2-input OR gate
IC17 = 74xx-eu:74*173: 4-bit D type REGISTER, 3-state
IC18 = 74xx-eu:74*02: Quad 2-input NOR gate

## Module PROGRAM_COUNTER
Ports: A_0(io) A_1(io) A_2(io) A_3(io) A_4(io) A_5(io) A_6(io) A_7(io) A_8(io) A_9(io) A_10(io) A_11(io) A_12(io) A_13(io) A_14(io) A_15(io) !PC_OUT(io) !PC_LOAD(io) PC_ADVANCE(in)
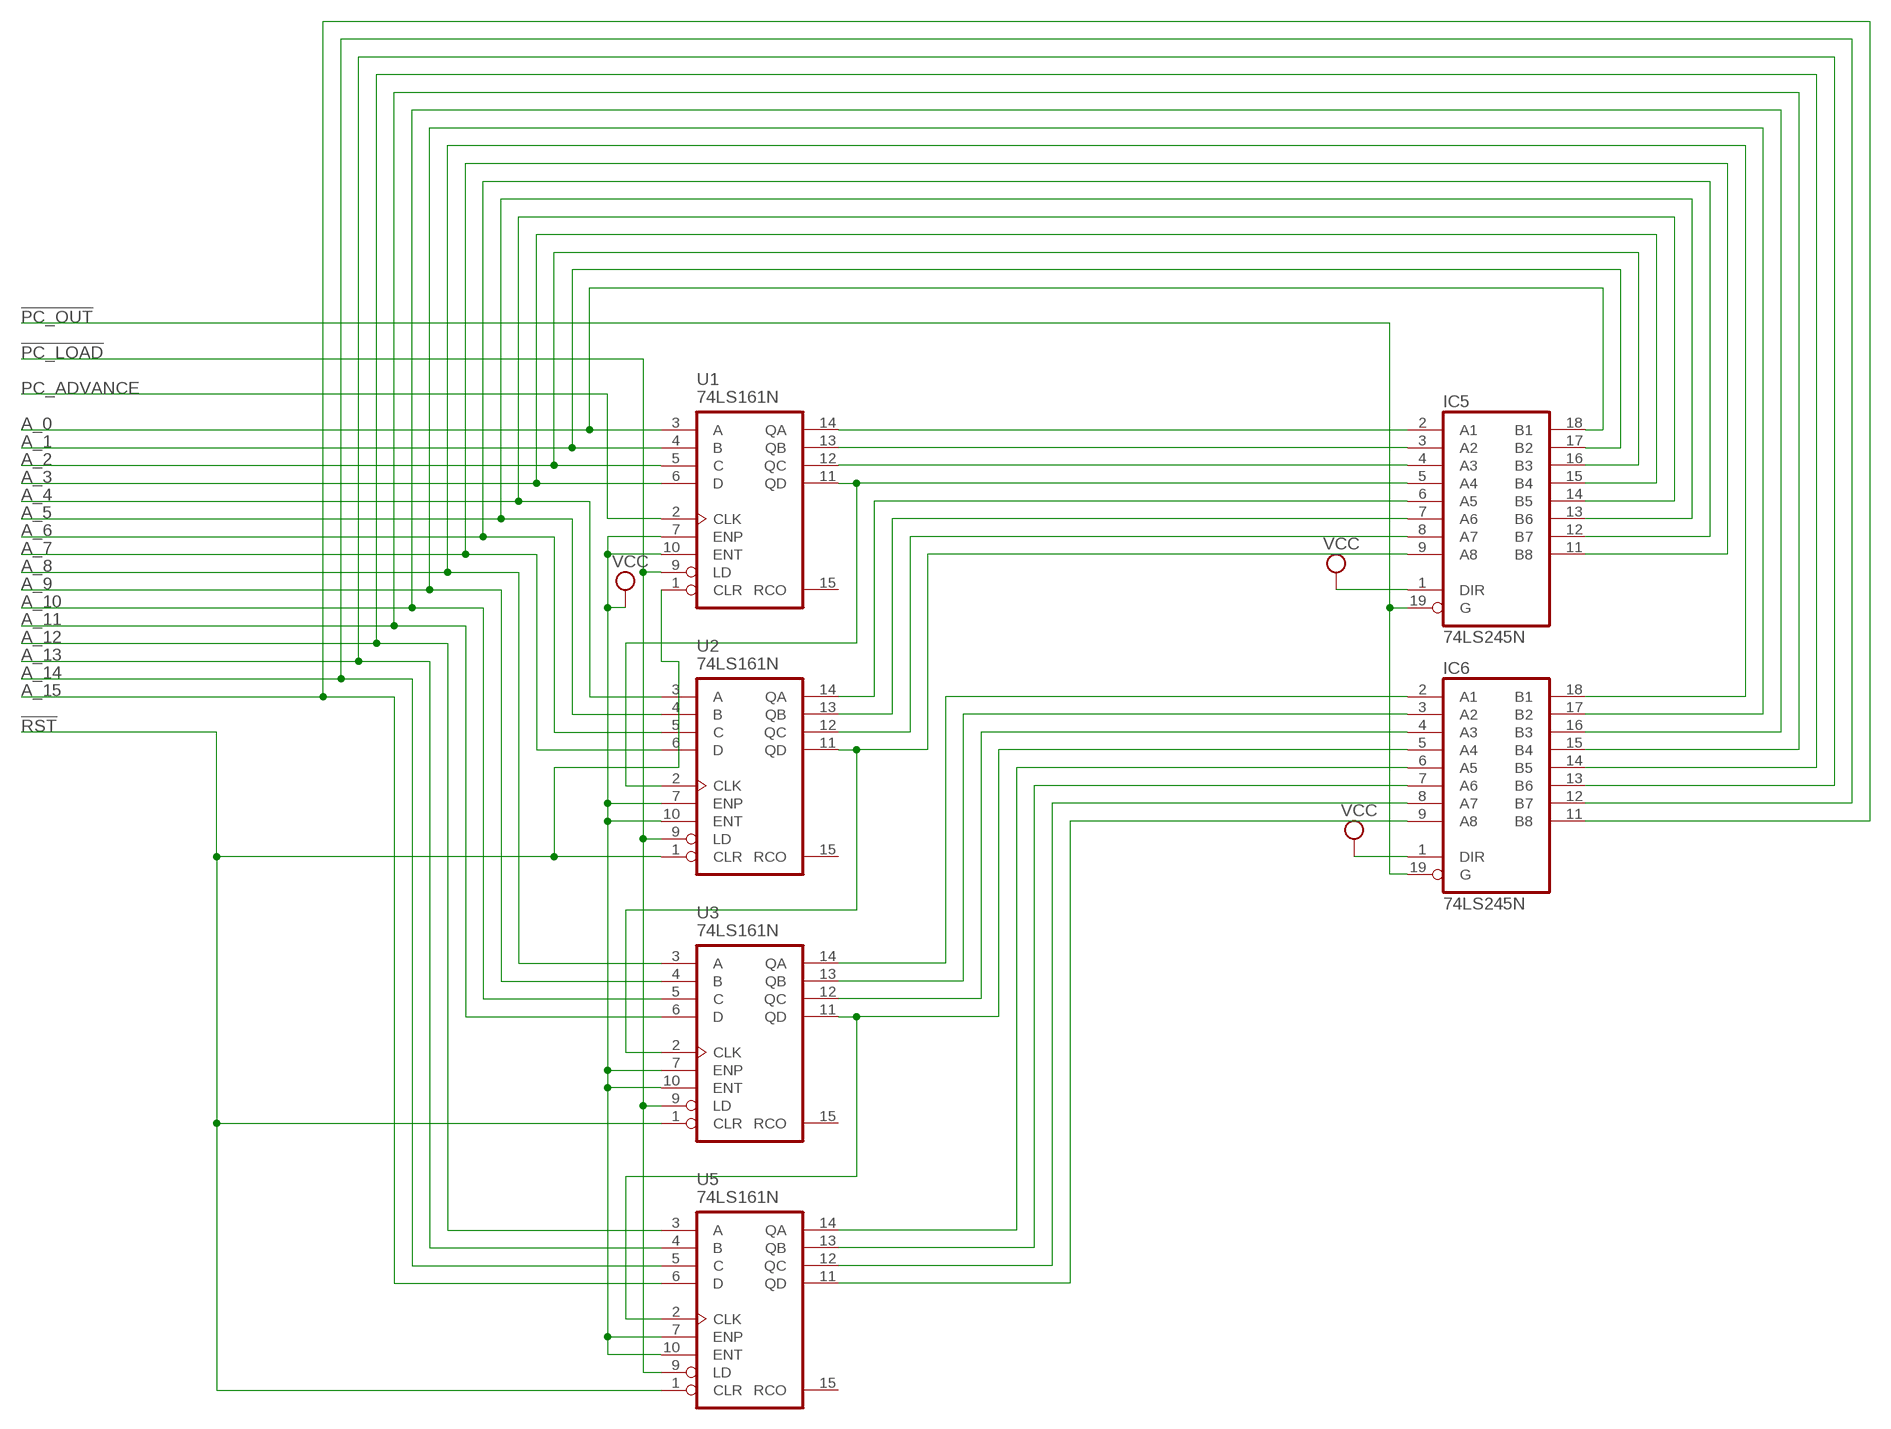
[diagram p8: schematic, module PROGRAM_COUNTER, sheet 1]

### Parts
IC5  74LS245N  [DIL20]
IC6  74LS245N  [DIL20]
U1  74LS161N  [DIL16]
U2  74LS161N  [DIL16]
U3  74LS161N  [DIL16]
U5  74LS161N  [DIL16]

### Nets
!PC_LOAD: U1.9(LD) U2.9(LD) U3.9(LD) U5.9(LD)
!PC_OUT: IC5.19(G) IC6.19(G)
!RST: U1.1(CLR) U2.1(CLR) U3.1(CLR) U5.1(CLR)
A_0: IC5.18(B1) U1.3(A)
A_1: IC5.17(B2) U1.4(B)
A_2: IC5.16(B3) U1.5(C)
A_3: IC5.15(B4) U1.6(D)
A_4: IC5.14(B5) U2.3(A)
A_5: IC5.13(B6) U2.4(B)
A_6: IC5.12(B7) U2.5(C)
A_7: IC5.11(B8) U2.6(D)
A_8: IC6.18(B1) U3.3(A)
A_9: IC6.17(B2) U3.4(B)
A_10: IC6.16(B3) U3.5(C)
A_11: IC6.15(B4) U3.6(D)
A_12: IC6.14(B5) U5.3(A)
A_13: IC6.13(B6) U5.4(B)
A_14: IC6.12(B7) U5.5(C)
A_15: IC6.11(B8) U5.6(D)
N$2: IC5.5(A4) U1.11(QD) U2.2(CLK)
N$3: IC5.9(A8) U2.11(QD) U3.2(CLK)
N$4: IC6.5(A4) U3.11(QD) U5.2(CLK)
N$23: IC5.2(A1) U1.14(QA)
N$24: IC5.3(A2) U1.13(QB)
N$25: IC5.4(A3) U1.12(QC)
N$26: IC5.6(A5) U2.14(QA)
N$27: IC5.7(A6) U2.13(QB)
N$28: IC5.8(A7) U2.12(QC)
N$30: IC6.2(A1) U3.14(QA)
N$31: IC6.3(A2) U3.13(QB)
N$32: IC6.4(A3) U3.12(QC)
N$34: IC6.6(A5) U5.14(QA)
N$35: IC6.7(A6) U5.13(QB)
N$36: IC6.8(A7) U5.12(QC)
N$37: IC6.9(A8) U5.11(QD)
PC_ADVANCE: U1.2(CLK)
VCC: IC5.1(DIR) IC6.1(DIR) U1.7(ENP) U1.10(ENT) U2.7(ENP) U2.10(ENT) U3.7(ENP) U3.10(ENT) U5.7(ENP) U5.10(ENT)
Unconnected: U1.15(RCO) U2.15(RCO) U3.15(RCO) U5.15(RCO)

### Power pins joined to a net without a drawn wire
GND: IC5.10(GND) IC6.10(GND) U1.8(GND) U2.8(GND) U3.8(GND) U5.8(GND)
VCC: IC5.20(VCC) IC6.20(VCC) U1.16(VCC) U2.16(VCC) U3.16(VCC) U5.16(VCC)

### Library data of the parts
IC5 IC6 = 74xx-eu:74*245: Octal BUS TRANSCEIVER, 3-state
U1-U3 U5 = oldchips:74*161: Synchronous 4-bit COUNTER with direct clear

## Module RAM
Ports: A_0(in) A_1(in) A_2(in) A_3(in) A_4(in) A_5(in) A_6(in) A_7(in) A_8(in) A_9(in) A_10(in) A_11(in) A_12(in) A_13(in) A_14(in) A_15(in) !OE(in) !WE(in) D_0(io) D_1(io) D_2(io) D_3(io) D_4(io) D_5(io) D_6(io) D_7(io)
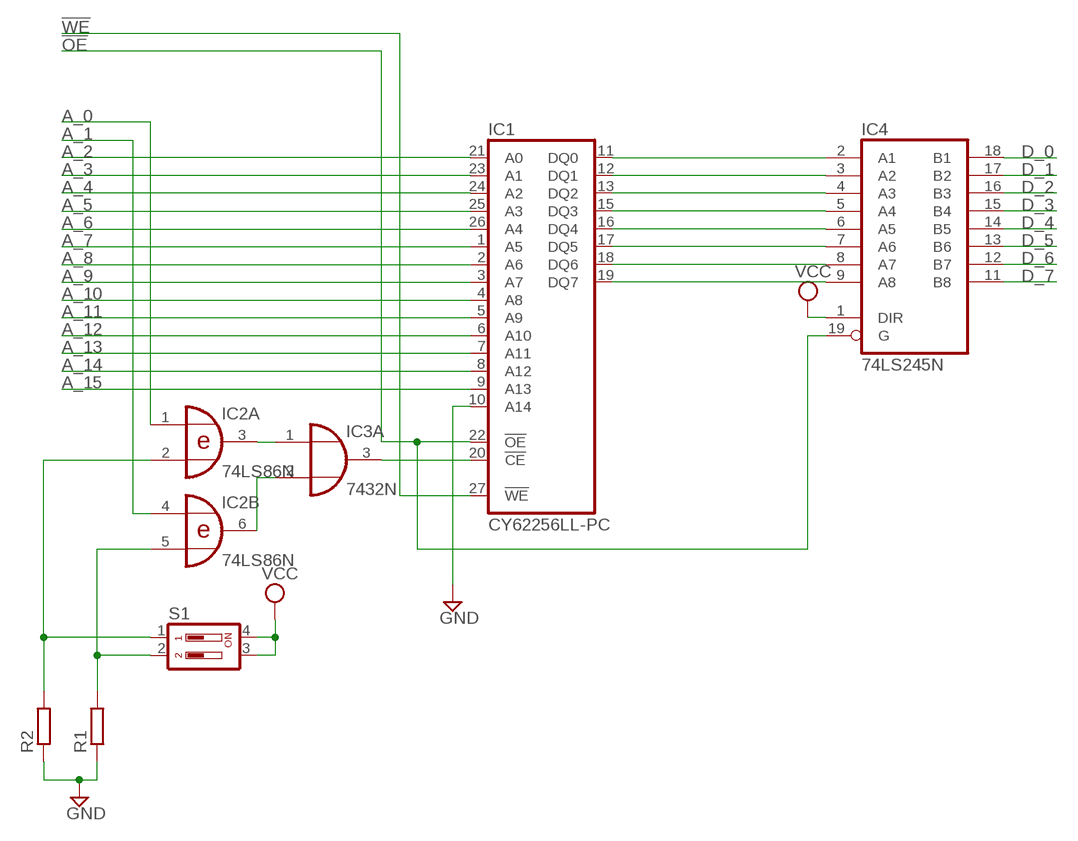
[diagram p9: schematic, module RAM, sheet 1]

### Parts
IC1  CY62256LL-PC  [DIL28-6]
IC2  74LS86N  [DIL14]
IC3  7432N  [DIL14]
IC4  74LS245N  [DIL20]
R1  R-EU_0207/7  [0207/7]
R2  R-EU_0207/7  [0207/7]
S1  DIP02YL  [DIP02YL]

### Nets
!OE: IC1.22(!OE) IC4.19(G)
!WE: IC1.27(!WE)
A_0: IC2.1(A:I0)
A_1: IC2.4(B:I0)
A_2: IC1.21(A0)
A_3: IC1.23(A1)
A_4: IC1.24(A2)
A_5: IC1.25(A3)
A_6: IC1.26(A4)
A_7: IC1.1(A5)
A_8: IC1.2(A6)
A_9: IC1.3(A7)
A_10: IC1.4(A8)
A_11: IC1.5(A9)
A_12: IC1.6(A10)
A_13: IC1.7(A11)
A_14: IC1.8(A12)
A_15: IC1.9(A13)
D_0: IC4.18(B1)
D_1: IC4.17(B2)
D_2: IC4.16(B3)
D_3: IC4.15(B4)
D_4: IC4.14(B5)
D_5: IC4.13(B6)
D_6: IC4.12(B7)
D_7: IC4.11(B8)
GND: IC1.10(A14) R1.1 R2.1
N$1: IC1.11(DQ0) IC4.2(A1)
N$2: IC1.12(DQ1) IC4.3(A2)
N$3: IC1.13(DQ2) IC4.4(A3)
N$4: IC1.15(DQ3) IC4.5(A4)
N$5: IC1.16(DQ4) IC4.6(A5)
N$6: IC1.17(DQ5) IC4.7(A6)
N$7: IC1.18(DQ6) IC4.8(A7)
N$8: IC1.19(DQ7) IC4.9(A8)
N$23: IC2.5(B:I1) R1.2 S1.2
N$24: IC2.2(A:I1) R2.2 S1.1
N$27: IC2.3(A:O) IC3.1(A:I0)
N$28: IC2.6(B:O) IC3.2(A:I1)
N$29: IC1.20(!CE) IC3.3(A:O)
VCC: IC4.1(DIR) S1.3 S1.4
Unconnected: IC2.8(C:O) IC2.9(C:I0) IC2.10(C:I1) IC2.11(D:O) IC2.12(D:I0) IC2.13(D:I1) IC3.4(B:I0) IC3.5(B:I1) IC3.6(B:O) IC3.8(C:O) IC3.9(C:I0) IC3.10(C:I1) IC3.11(D:O) IC3.12(D:I0) IC3.13(D:I1)

### Power pins joined to a net without a drawn wire
GND: IC1.14(GND) IC2.7(P:GND) IC3.7(P:GND) IC4.10(GND)
VCC: IC1.28(VCC) IC2.14(P:VCC) IC3.14(P:VCC) IC4.20(VCC)

### Library data of the parts
IC1 = memory-sram:CY62256LL-?*: 256K (32K x 8) CMOS-Static RAM Source: http://download.cypress.com.edgesuite.net/design_resources/datasheets/contents/cy62256_8.pdf
IC2 = 74xx-eu:74*86: Quad 2-input EXCLUSIVE-OR (XOR) gate
IC3 = 74xx-eu:74*32: Quad 2-input OR gate
IC4 = 74xx-eu:74*245: Octal BUS TRANSCEIVER, 3-state
R1 R2 = resistor:R-EU_: RESISTOR, European symbol
S1 = switch-dil:DIP02YL: DIL/CODE SWITCH; OC_FARNELL: unknown; OC_NEWARK: unknown

## Module INSTRUCTION_REGISTER
Ports: I0(in) I1(in) I2(in) I3(in) I4(in) I5(in) I6(in) I7(in) O0(out) O1(out) O2(out) O3(out) O4(out) O5(out) O6(out) O7(out) !INPUT_ENABLE(in) CLK(in) CLR(in)
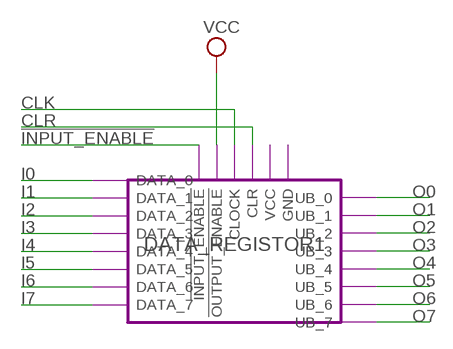
[diagram p10: schematic, module INSTRUCTION_REGISTER, sheet 1]

### Module instances
DATA_REGISTOR1 = DATA_REGISTOR

### Nets
!INPUT_ENABLE: port DATA_REGISTOR1.!INPUT_ENABLE
CLK: port DATA_REGISTOR1.CLOCK
CLR: port DATA_REGISTOR1.CLR
I0: port DATA_REGISTOR1.DATA_0
I1: port DATA_REGISTOR1.DATA_1
I2: port DATA_REGISTOR1.DATA_2
I3: port DATA_REGISTOR1.DATA_3
I4: port DATA_REGISTOR1.DATA_4
I5: port DATA_REGISTOR1.DATA_5
I6: port DATA_REGISTOR1.DATA_6
I7: port DATA_REGISTOR1.DATA_7
O0: port DATA_REGISTOR1.UB_0
O1: port DATA_REGISTOR1.UB_1
O2: port DATA_REGISTOR1.UB_2
O3: port DATA_REGISTOR1.UB_3
O4: port DATA_REGISTOR1.UB_4
O5: port DATA_REGISTOR1.UB_5
O6: port DATA_REGISTOR1.UB_6
O7: port DATA_REGISTOR1.UB_7
VCC: port DATA_REGISTOR1.!OUTPUT_ENABLE

### Library data of the parts

## Module IO_PANEL
Ports: ADDR0(in) ADDR1(in) ADDR2(in) ADDR3(in) ADDR4(in) ADDR5(in) ADDR6(in) ADDR7(in) ADDR8(in) ADDR9(in) ADDR10(in) ADDR11(in) ADDR12(in) ADDR13(in) ADDR15(in) ADDR14(in) D0(io) D1(io) D2(io) D3(io) D4(io) D5(io) D6(io) D7(io) READY(out) !W(in) R(in)
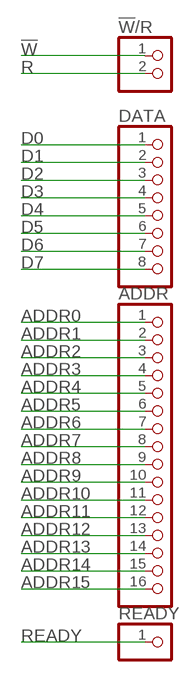
[diagram p11: schematic, module IO_PANEL, sheet 1]

### Parts
!W!/R  PINHD-1X2/90  [1X02/90]
ADDR  PINHD-1X16/90  [1X16/90]
DATA  PINHD-1X8/90  [1X08/90]
READY  PINHD-1X1  [1X01]

### Nets
!W: !W!/R.1
ADDR0: ADDR.1
ADDR1: ADDR.2
ADDR2: ADDR.3
ADDR3: ADDR.4
ADDR4: ADDR.5
ADDR5: ADDR.6
ADDR6: ADDR.7
ADDR7: ADDR.8
ADDR8: ADDR.9
ADDR9: ADDR.10
ADDR10: ADDR.11
ADDR11: ADDR.12
ADDR12: ADDR.13
ADDR13: ADDR.14
ADDR14: ADDR.15
ADDR15: ADDR.16
D0: DATA.1
D1: DATA.2
D2: DATA.3
D3: DATA.4
D4: DATA.5
D5: DATA.6
D6: DATA.7
D7: DATA.8
R: !W!/R.2
READY: READY.1

### Library data of the parts
!W!/R = pinhead:PINHD-1X2: PIN HEADER
ADDR = pinhead:PINHD-1X16: PIN HEADER
DATA = pinhead:PINHD-1X8: PIN HEADER
READY = pinhead:PINHD-1X1: PIN HEADER

## Module LOGIC_CONTROL_UNIT
Ports: I2(in) I3(in) I4(in) I5(in) I6(in) I7(in) PC_AD(out) PC_I(out) PC_O(out) D2A_HI_IN(out) D2A_LO_IN(out) M_WRITE(out) M_READ(out) MAR_IN(out) INSTRUCTION_IN(out) HL_TO_ADDR(out) LO(out) LI(out) HO(out) HI(out) EO(out) EI(out) DTA_OUT(out) DO(out) DI(out) CO(out) CI(out) BO(out) BI(out) AO(out) AI(out) ADD(out) SUB(out) AND(out) OR(out) XOR(out) RST(out) CF(in) NF(in) ZF(in) READY(in) !CLK(in) VCC(pwr) GND(pwr) HALT(out)
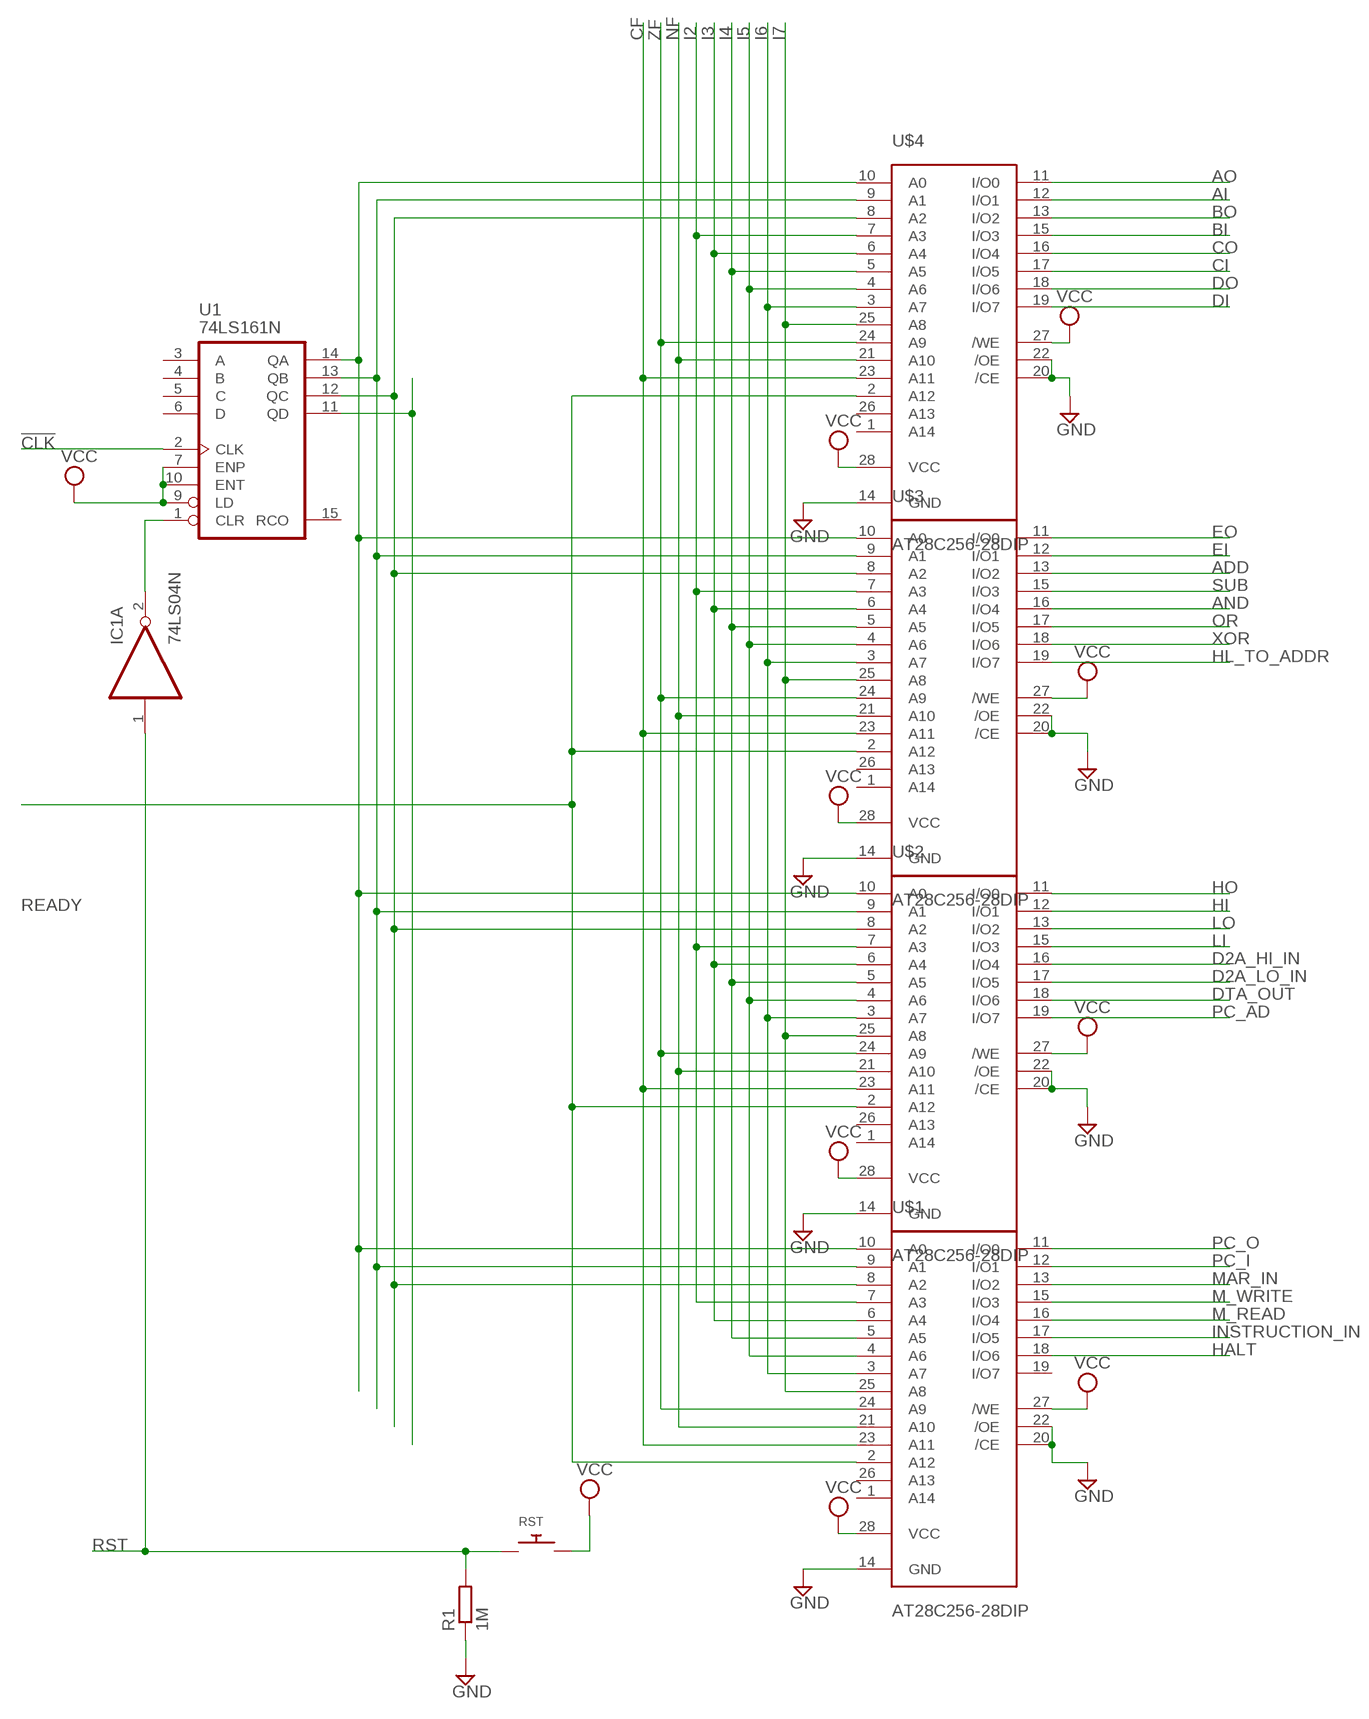
[diagram p12: schematic, module LOGIC_CONTROL_UNIT, sheet 1]

### Parts
IC1  74LS04N  [DIL14]
R1  1M  R-EU_0207/7  [0207/7]
RST  SWITCH_PUSHBUTTONSOFTTOUCHSMD_SJ  [PUSHBUTTON_SMD_SJ]
U1  74LS161N  [DIL16]
U$1  AT28C256-28DIP  [DIL28-6]
U$2  AT28C256-28DIP  [DIL28-6]
U$3  AT28C256-28DIP  [DIL28-6]
U$4  AT28C256-28DIP  [DIL28-6]

### Nets
!CLK: U1.2(CLK)
ADD: U$3.13(I/O2)
AI: U$4.12(I/O1)
AND: U$3.16(I/O4)
AO: U$4.11(I/O0)
BI: U$4.15(I/O3)
BO: U$4.13(I/O2)
CF: U$1.23(A11) U$2.23(A11) U$3.23(A11) U$4.23(A11)
CI: U$4.17(I/O5)
CO: U$4.16(I/O4)
D2A_HI_IN: U$2.16(I/O4)
D2A_LO_IN: U$2.17(I/O5)
DI: U$4.19(I/O7)
DO: U$4.18(I/O6)
DTA_OUT: U$2.18(I/O6)
EI: U$3.12(I/O1)
EO: U$3.11(I/O0)
GND: R1.1 U$1.14(GND) U$1.20(/CE) U$1.22(/OE) U$2.14(GND) U$2.20(/CE) U$2.22(/OE) U$3.14(GND) U$3.20(/CE) U$3.22(/OE) U$4.14(GND) U$4.20(/CE) U$4.22(/OE)
HALT: U$1.18(I/O6)
HI: U$2.12(I/O1)
HL_TO_ADDR: U$3.19(I/O7)
HO: U$2.11(I/O0)
I2: U$1.7(A3) U$2.7(A3) U$3.7(A3) U$4.7(A3)
I3: U$1.6(A4) U$2.6(A4) U$3.6(A4) U$4.6(A4)
I4: U$1.5(A5) U$2.5(A5) U$3.5(A5) U$4.5(A5)
I5: U$1.4(A6) U$2.4(A6) U$3.4(A6) U$4.4(A6)
I6: U$1.3(A7) U$2.3(A7) U$3.3(A7) U$4.3(A7)
I7: U$1.25(A8) U$2.25(A8) U$3.25(A8) U$4.25(A8)
INSTRUCTION_IN: U$1.17(I/O5)
LI: U$2.15(I/O3)
LO: U$2.13(I/O2)
M_READ: U$1.16(I/O4)
M_WRITE: U$1.15(I/O3)
MAR_IN: U$1.13(I/O2)
N$1: U1.14(QA) U$1.10(A0) U$2.10(A0) U$3.10(A0) U$4.10(A0)
N$2: IC1.2(A:O) U1.1(CLR)
N$10: U1.13(QB) U$1.9(A1) U$2.9(A1) U$3.9(A1) U$4.9(A1)
N$11: U1.12(QC) U$1.8(A2) U$2.8(A2) U$3.8(A2) U$4.8(A2)
N$12: U1.11(QD)
NF: U$1.21(A10) U$2.21(A10) U$3.21(A10) U$4.21(A10)
OR: U$3.17(I/O5)
PC_AD: U$2.19(I/O7)
PC_I: U$1.12(I/O1)
PC_O: U$1.11(I/O0)
READY: U$1.2(A12) U$2.2(A12) U$3.2(A12) U$4.2(A12)
RST: IC1.1(A:I) R1.2 RST.P$1
SUB: U$3.15(I/O3)
VCC: RST.P$2 U1.7(ENP) U1.9(LD) U1.10(ENT) U$1.27(/WE) U$1.28(VCC) U$2.27(/WE) U$2.28(VCC) U$3.27(/WE) U$3.28(VCC) U$4.27(/WE) U$4.28(VCC)
XOR: U$3.18(I/O6)
ZF: U$1.24(A9) U$2.24(A9) U$3.24(A9) U$4.24(A9)
Unconnected: IC1.3(B:I) IC1.4(B:O) IC1.5(C:I) IC1.6(C:O) IC1.8(D:O) IC1.9(D:I) IC1.10(E:O) IC1.11(E:I) IC1.12(F:O) IC1.13(F:I) U1.3(A) U1.4(B) U1.5(C) U1.6(D) U1.15(RCO) U$1.1(A14) U$1.19(I/O7) U$1.26(A13) U$2.1(A14) U$2.26(A13) U$3.1(A14) U$3.26(A13) U$4.1(A14) U$4.26(A13)

### Power pins joined to a net without a drawn wire
GND: IC1.7(P:GND) U1.8(GND)
VCC: IC1.14(P:VCC) U1.16(VCC)

### Library data of the parts
IC1 = 74xx-eu:74*04: Hex INVERTER
R1 = resistor:R-EU_: RESISTOR, European symbol
RST = adafruit:SWITCH_PUSHBUTTON: Buttons SOFTTOUCHSMD_SJ - Soft touch temporary push button (Super Junk Akihabara) Compatible with SKPMANE010 [Mouser: 688-SKPMAN] C&K_KSS = Digikey: KSS221GLFS; SPICEPREFIX: B
U1 = oldchips:74*161: Synchronous 4-bit COUNTER with direct clear
U$1-U$4 = atmel-custom:AT28C256-28DIP: IC EEPROM 256KBIT 150NS 28DIP

## Module DATA_TO_ADDR
Ports: D0(in) D1(in) D2(in) D3(in) D4(in) D5(in) D6(in) D7(in) >CLK(in) !HI_IN(in) !LO_IN(in) !OUTPUT_ENABLE(in) VCC(pwr) GND(pwr) A0(out) A1(out) A2(out) A3(out) A4(out) A5(out) A6(out) A7(out) A8(out) A9(out) A10(out) A11(out) A12(out) A13(out) A14(out) A15(out)
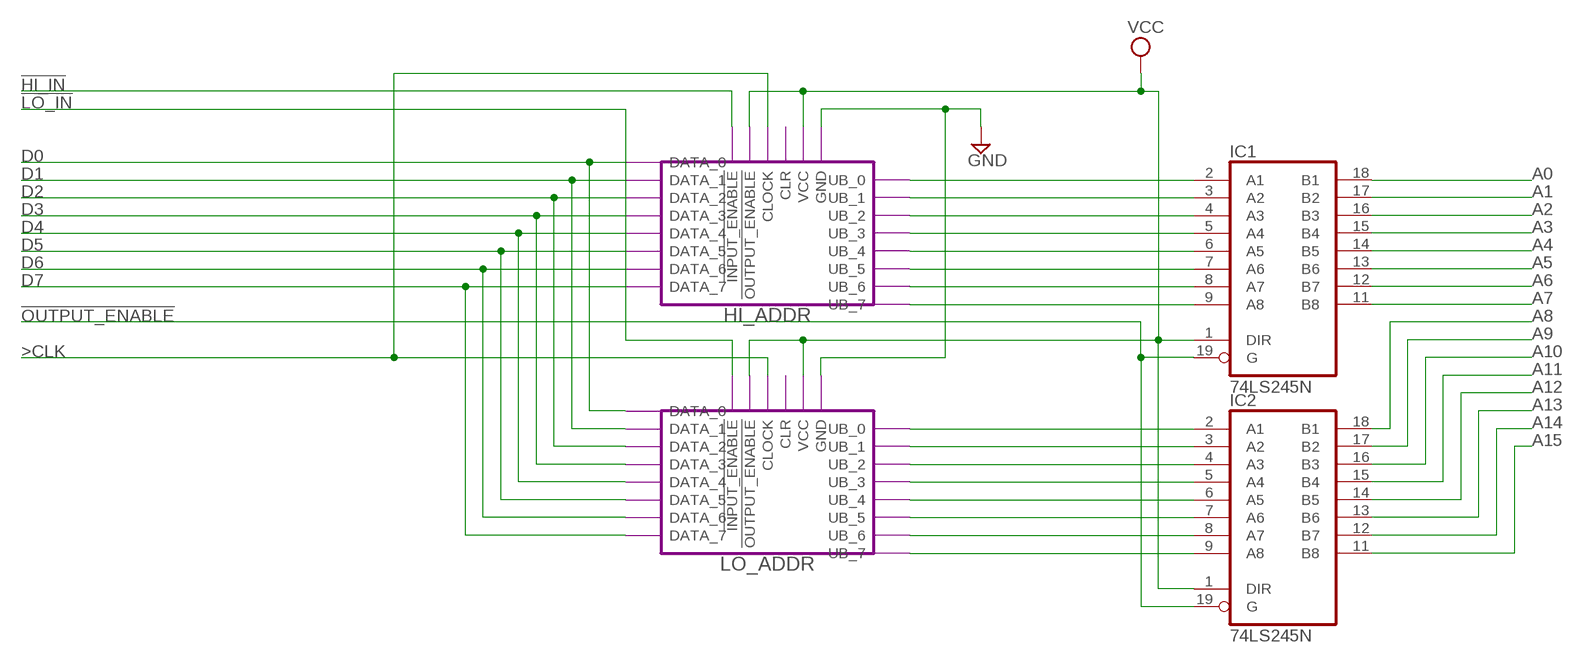
[diagram p13: schematic, module DATA_TO_ADDR, sheet 1]

### Parts
IC1  74LS245N  [DIL20]
IC2  74LS245N  [DIL20]

### Module instances
HI_ADDR = DATA_REGISTOR
LO_ADDR = DATA_REGISTOR

### Nets
!HI_IN: port HI_ADDR.!INPUT_ENABLE
!LO_IN: port LO_ADDR.!INPUT_ENABLE
!OUTPUT_ENABLE: IC1.19(G) IC2.19(G)
>CLK: port LO_ADDR.CLOCK HI_ADDR.CLOCK
A0: IC1.18(B1)
A1: IC1.17(B2)
A2: IC1.16(B3)
A3: IC1.15(B4)
A4: IC1.14(B5)
A5: IC1.13(B6)
A6: IC1.12(B7)
A7: IC1.11(B8)
A8: IC2.18(B1)
A9: IC2.17(B2)
A10: IC2.16(B3)
A11: IC2.15(B4)
A12: IC2.14(B5)
A13: IC2.13(B6)
A14: IC2.12(B7)
A15: IC2.11(B8)
D0: port HI_ADDR.DATA_0 LO_ADDR.DATA_0
D1: port HI_ADDR.DATA_1 LO_ADDR.DATA_1
D2: port HI_ADDR.DATA_2 LO_ADDR.DATA_2
D3: port HI_ADDR.DATA_3 LO_ADDR.DATA_3
D4: port HI_ADDR.DATA_4 LO_ADDR.DATA_4
D5: port HI_ADDR.DATA_5 LO_ADDR.DATA_5
D6: port HI_ADDR.DATA_6 LO_ADDR.DATA_6
D7: port HI_ADDR.DATA_7 LO_ADDR.DATA_7
GND: port LO_ADDR.GND HI_ADDR.GND
N$16: IC1.2(A1) ; port HI_ADDR.UB_0
N$17: IC1.3(A2) ; port HI_ADDR.UB_1
N$18: IC1.4(A3) ; port HI_ADDR.UB_2
N$19: IC1.5(A4) ; port HI_ADDR.UB_3
N$20: IC1.6(A5) ; port HI_ADDR.UB_4
N$21: IC1.7(A6) ; port HI_ADDR.UB_5
N$22: IC1.8(A7) ; port HI_ADDR.UB_6
N$23: IC1.9(A8) ; port HI_ADDR.UB_7
N$24: IC2.2(A1) ; port LO_ADDR.UB_0
N$25: IC2.3(A2) ; port LO_ADDR.UB_1
N$26: IC2.4(A3) ; port LO_ADDR.UB_2
N$27: IC2.5(A4) ; port LO_ADDR.UB_3
N$28: IC2.6(A5) ; port LO_ADDR.UB_4
N$29: IC2.7(A6) ; port LO_ADDR.UB_5
N$30: IC2.8(A7) ; port LO_ADDR.UB_6
N$31: IC2.9(A8) ; port LO_ADDR.UB_7
VCC: IC1.1(DIR) IC2.1(DIR) ; port HI_ADDR.VCC HI_ADDR.!OUTPUT_ENABLE LO_ADDR.!OUTPUT_ENABLE LO_ADDR.VCC

### Power pins joined to a net without a drawn wire
GND: IC1.10(GND) IC2.10(GND)
VCC: IC1.20(VCC) IC2.20(VCC)

### Library data of the parts
IC1 IC2 = 74xx-eu:74*245: Octal BUS TRANSCEIVER, 3-state

## Module ROM
Ports: A_0(in) A_1(in) A_2(in) A_3(in) A_4(in) A_5(in) A_6(in) A_7(in) A_8(in) A_9(in) A_10(in) A_11(in) A_12(in) A_13(in) A_14(in) A_15(in) !OE(in) D_0(out) D_1(out) D_2(out) D_4(out) D_3(out) D_5(out) D_6(out) D_7(out)
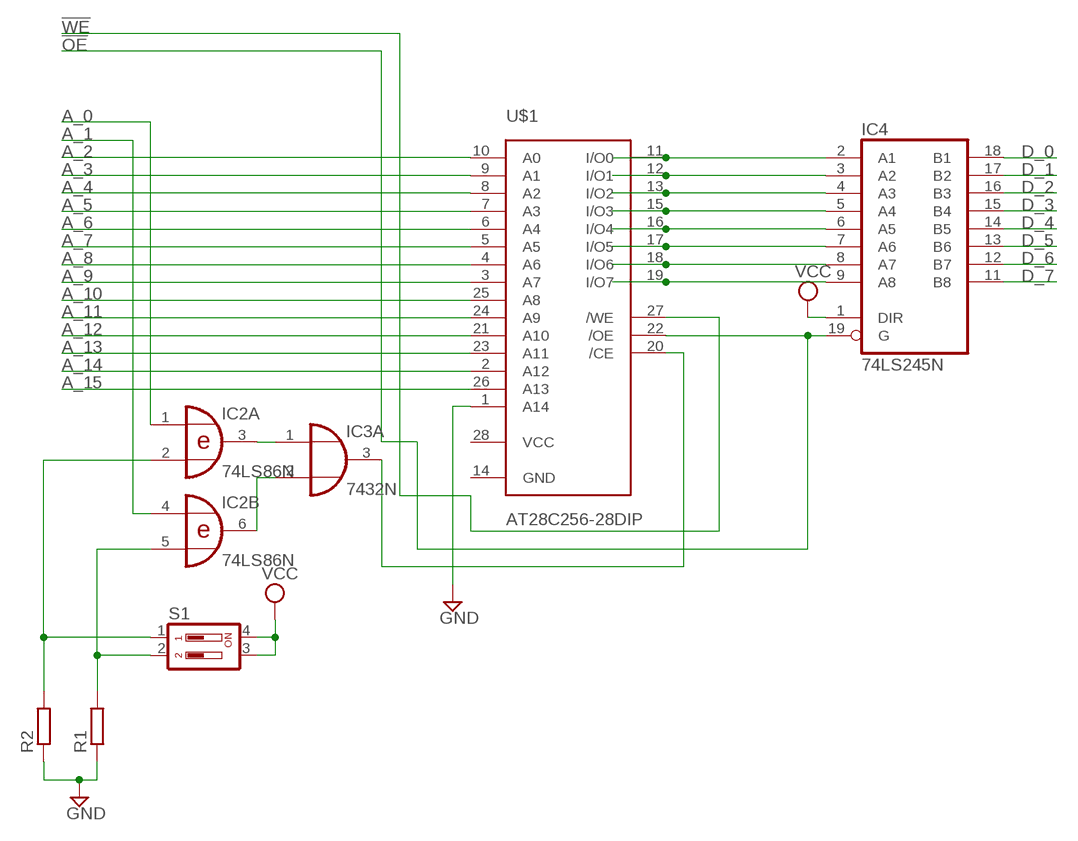
[diagram p14: schematic, module ROM, sheet 1]

### Parts
IC2  74LS86N  [DIL14]
IC3  7432N  [DIL14]
IC4  74LS245N  [DIL20]
R1  R-EU_0207/7  [0207/7]
R2  R-EU_0207/7  [0207/7]
S1  DIP02YL  [DIP02YL]
U$1  AT28C256-28DIP  [DIL28-6]

### Nets
!OE: IC4.19(G) U$1.22(/OE)
!WE: U$1.27(/WE)
A_0: IC2.1(A:I0)
A_1: IC2.4(B:I0)
A_2: U$1.10(A0)
A_3: U$1.9(A1)
A_4: U$1.8(A2)
A_5: U$1.7(A3)
A_6: U$1.6(A4)
A_7: U$1.5(A5)
A_8: U$1.4(A6)
A_9: U$1.3(A7)
A_10: U$1.25(A8)
A_11: U$1.24(A9)
A_12: U$1.21(A10)
A_13: U$1.23(A11)
A_14: U$1.2(A12)
A_15: U$1.26(A13)
D_0: IC4.18(B1)
D_1: IC4.17(B2)
D_2: IC4.16(B3)
D_3: IC4.15(B4)
D_4: IC4.14(B5)
D_5: IC4.13(B6)
D_6: IC4.12(B7)
D_7: IC4.11(B8)
GND: R1.1 R2.1 U$1.1(A14)
N$1: IC4.2(A1) U$1.11(I/O0)
N$2: IC4.3(A2) U$1.12(I/O1)
N$3: IC4.4(A3) U$1.13(I/O2)
N$4: IC4.5(A4) U$1.15(I/O3)
N$5: IC4.6(A5) U$1.16(I/O4)
N$6: IC4.7(A6) U$1.17(I/O5)
N$7: IC4.8(A7) U$1.18(I/O6)
N$8: IC4.9(A8) U$1.19(I/O7)
N$23: IC2.5(B:I1) R1.2 S1.2
N$24: IC2.2(A:I1) R2.2 S1.1
N$27: IC2.3(A:O) IC3.1(A:I0)
N$28: IC2.6(B:O) IC3.2(A:I1)
N$29: IC3.3(A:O) U$1.20(/CE)
VCC: IC4.1(DIR) S1.3 S1.4
Unconnected: IC2.8(C:O) IC2.9(C:I0) IC2.10(C:I1) IC2.11(D:O) IC2.12(D:I0) IC2.13(D:I1) IC3.4(B:I0) IC3.5(B:I1) IC3.6(B:O) IC3.8(C:O) IC3.9(C:I0) IC3.10(C:I1) IC3.11(D:O) IC3.12(D:I0) IC3.13(D:I1) U$1.14(GND) U$1.28(VCC)

### Power pins joined to a net without a drawn wire
GND: IC2.7(P:GND) IC3.7(P:GND) IC4.10(GND)
VCC: IC2.14(P:VCC) IC3.14(P:VCC) IC4.20(VCC)

### Library data of the parts
IC2 = 74xx-eu:74*86: Quad 2-input EXCLUSIVE-OR (XOR) gate
IC3 = 74xx-eu:74*32: Quad 2-input OR gate
IC4 = 74xx-eu:74*245: Octal BUS TRANSCEIVER, 3-state
R1 R2 = resistor:R-EU_: RESISTOR, European symbol
S1 = switch-dil:DIP02YL: DIL/CODE SWITCH; OC_FARNELL: unknown; OC_NEWARK: unknown
U$1 = atmel-custom:AT28C256-28DIP: IC EEPROM 256KBIT 150NS 28DIP